# EAGLE design Auxiliary-Payload v3.6 (EAGLE 7.2.0)
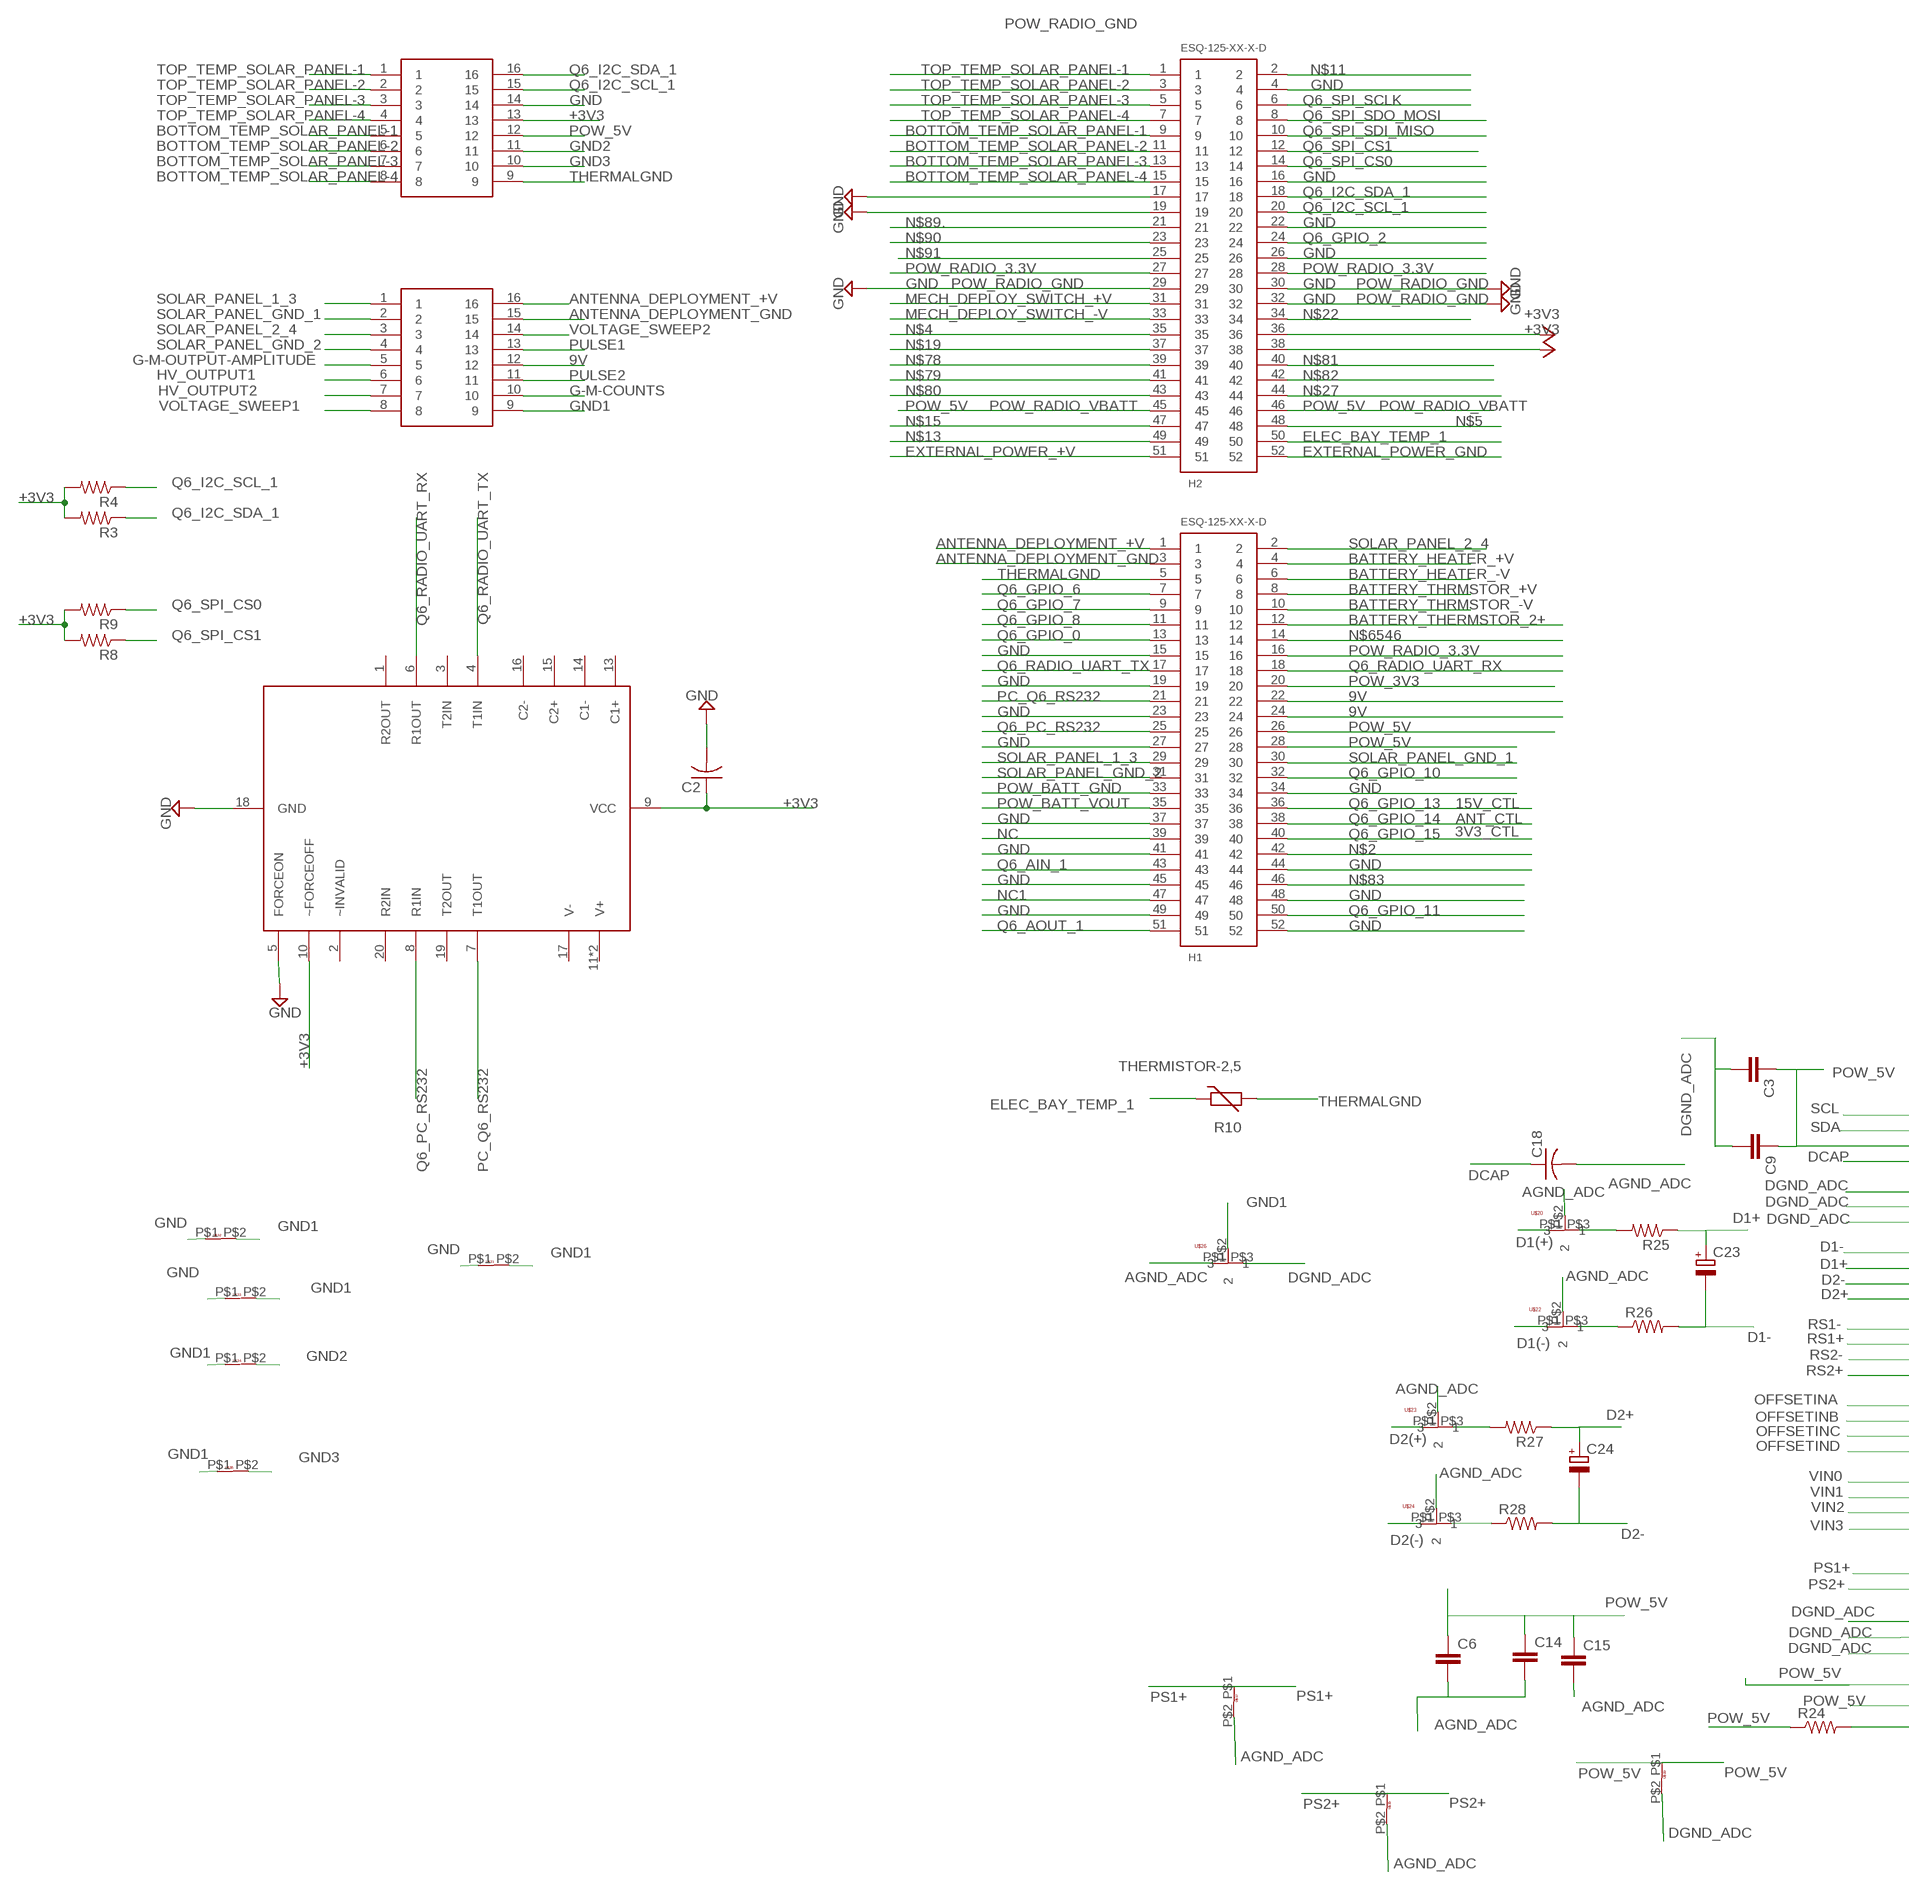
[diagram p0: schematic, sheet 1, part 1 of 2]
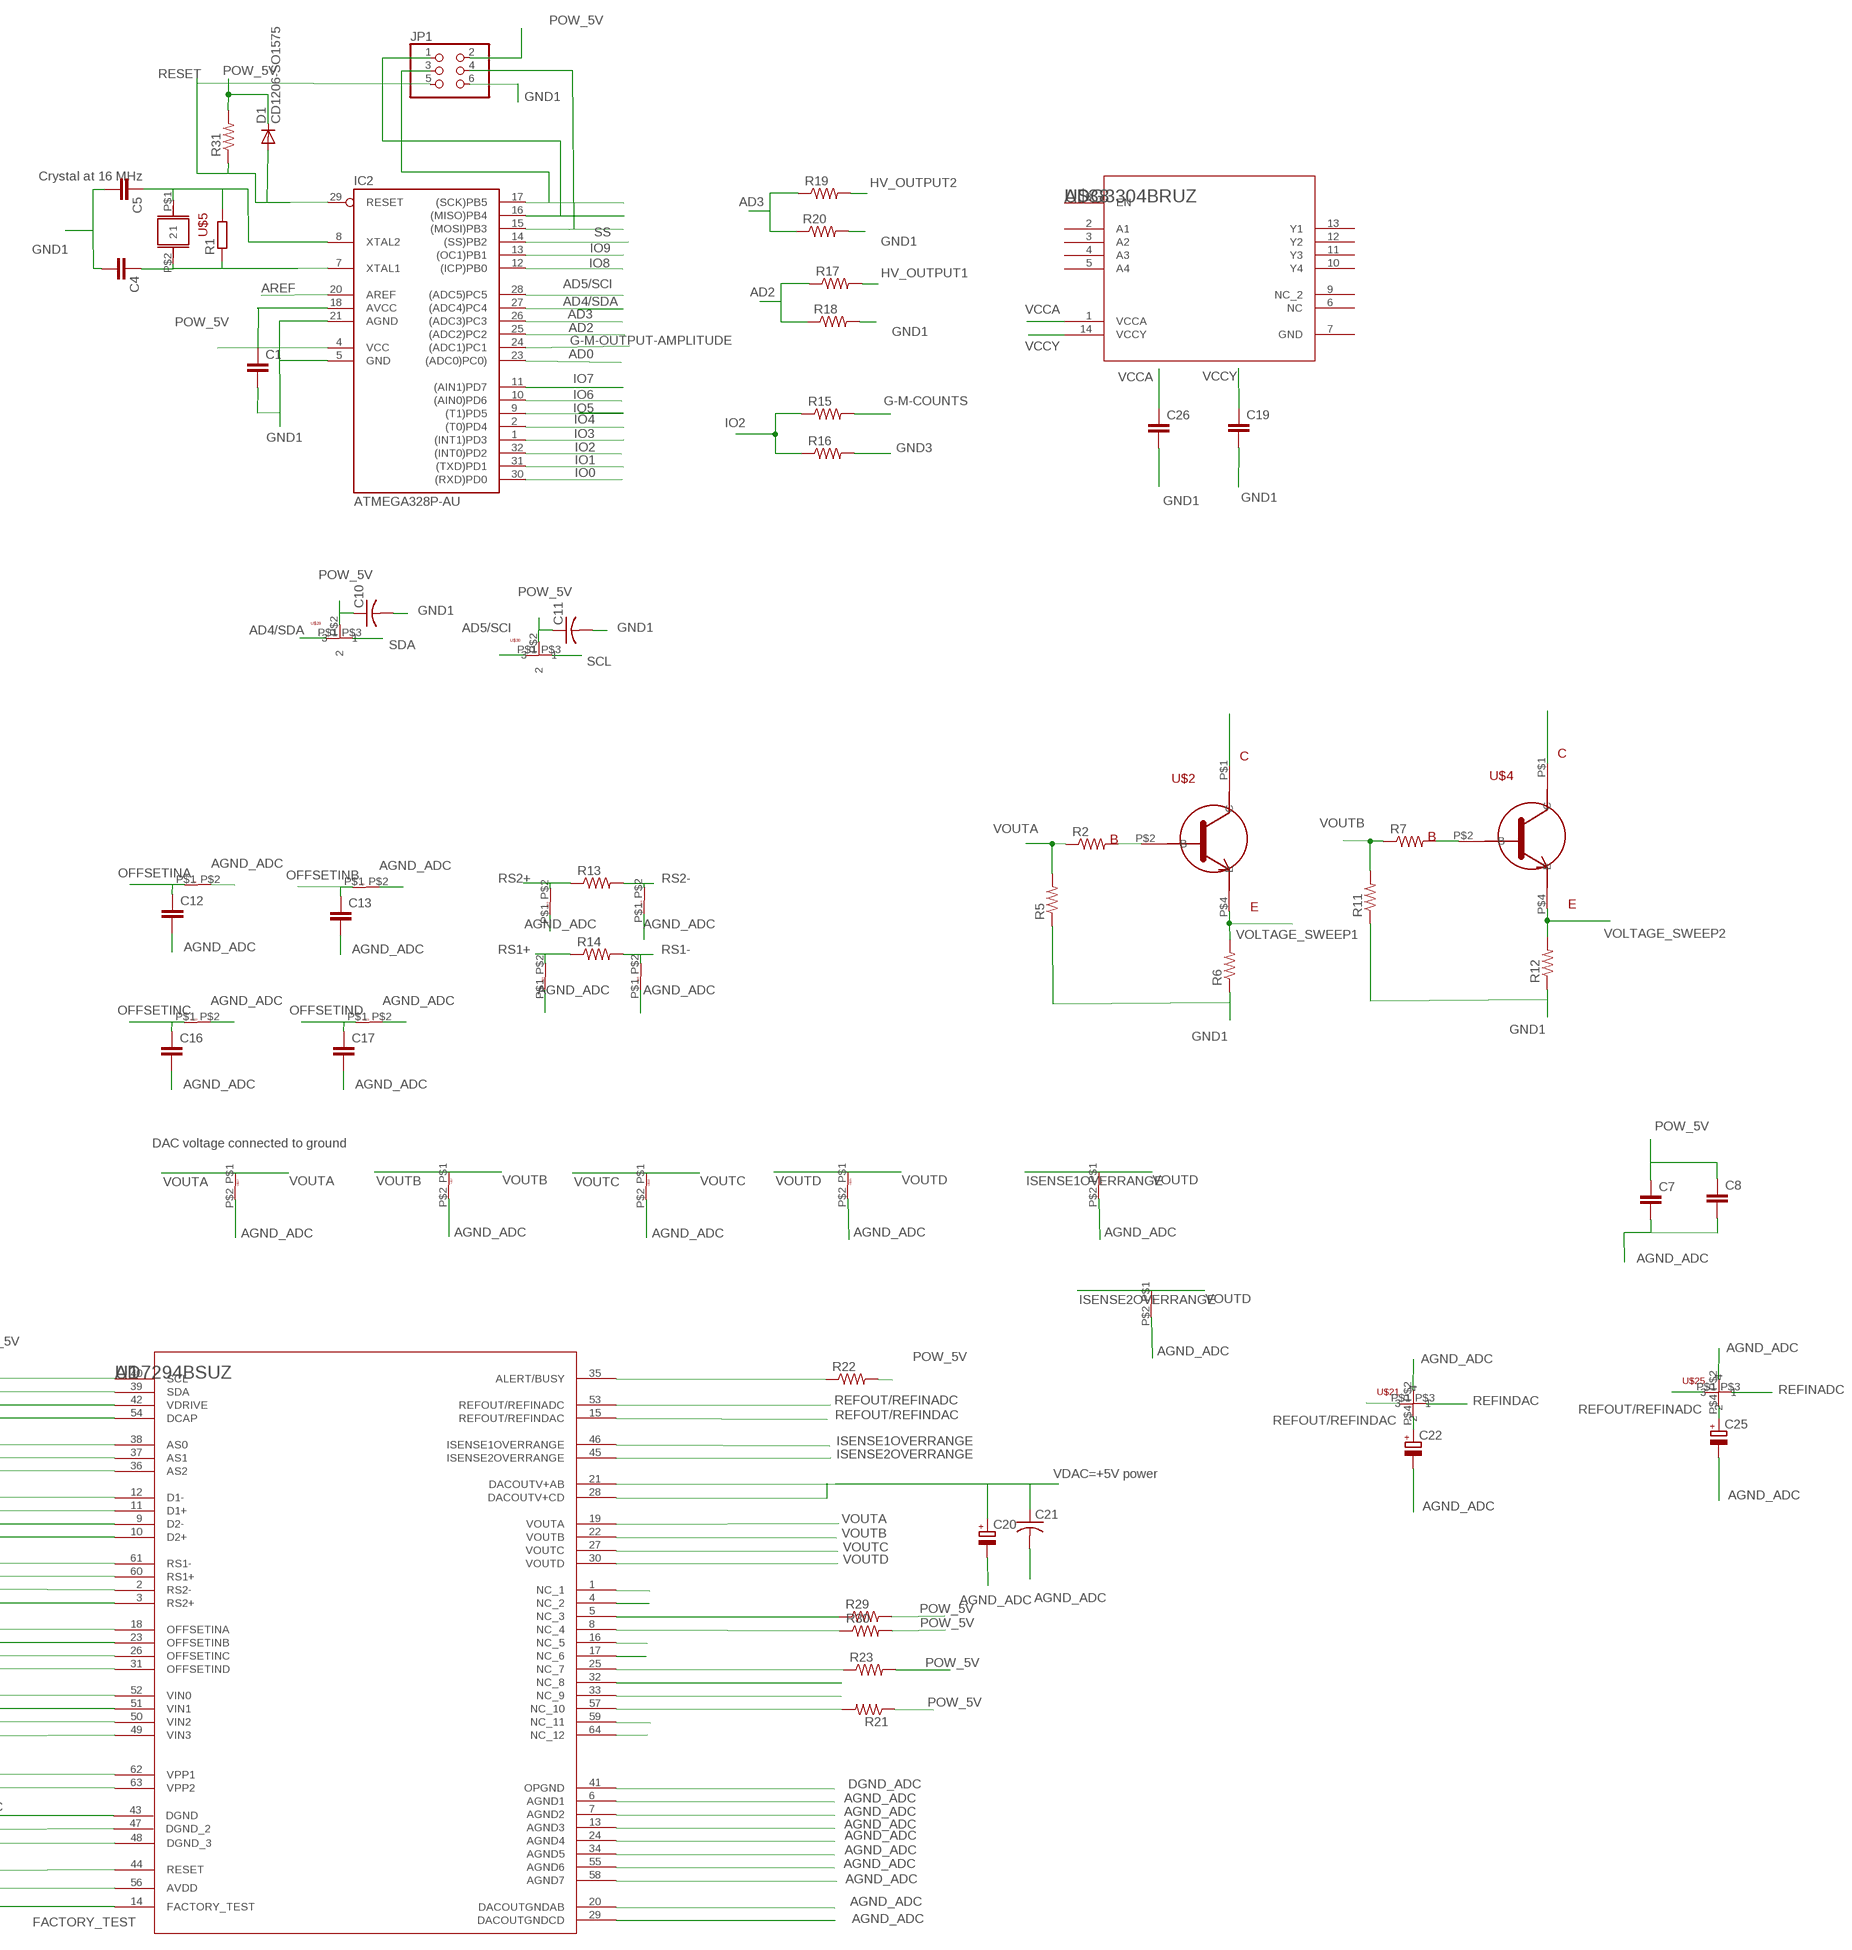
[diagram p1: schematic, sheet 1, part 2 of 2]

## Parts
C1  C-EUC0603  [C0603-ROUND]
C2  C-USC2012  [C2012]
C3  C-EUC1206  [C1206]
C4  C-EUC0603  [C0603-ROUND]
C5  C-EUC0603  [C0603-ROUND]
C6  C-EUC1206  [C1206]
C7  C-EUC1206  [C1206]
C8  C-EUC0603  [C0603]
C9  C-EUC0603  [C0603]
C10  C-USC1210  [C1210]
C11  C-USC1210  [C1210]
C12  C-EUC0603  [C0603]
C13  C-EUC0603  [C0603]
C14  C-EUC0603  [C0603]
C15  C-EUC0603  [C0603]
C16  C-EUC0603  [C0603]
C17  C-EUC0603  [C0603]
C18  C-USC0603  [C0603]
C19  C-EUC0603  [C0603]
C20  CPOL-EUC/6032-28W  [C/6032-28W]
C21  C-USC0603  [C0603]
C22  CPOL-EUC/6032-28W  [C/6032-28W]
C23  CPOL-EUC/6032-28W  [C/6032-28W]
C24  CPOL-EUC/6032-28W  [C/6032-28W]
C25  CPOL-EUC/6032-28W  [C/6032-28W]
C26  C-EUC0603  [C0603]
D1  CD1206-SO1575  DIODE-MINIMELF  [MINIMELF]
H1  ESQ-125-XX-X-D  [ESQ-125-XX-X-D]
H2  ESQ-125-XX-X-D  [ESQ-125-XX-X-D]
IC2  ATMEGA328P-AU  [TQFP32-08]
JP1  PINHD-2X3  [2X03]
R1  R-EU_0603-RND  [R0603-ROUND]
R2  R-US_R1206  [R1206]
R3  R-US_R2012  [R2012]
R4  R-US_R2012  [R2012]
R5  R-US_R2010  [R2010]
R6  R-US_R2010  [R2010]
R7  R-US_R1206  [R1206]
R8  R-US_R2012  [R2012]
R9  R-US_R2012  [R2012]
R10  THERMISTOR-2,5  [RS-2,5]
R11  R-US_R2010  [R2010]
R12  R-US_R2010  [R2010]
R13  R-US_R0805  [R0805]
R14  R-US_R0805  [R0805]
R15  R-US_R1206  [R1206]
R16  R-US_R1206  [R1206]
R17  R-US_R0805  [R0805]
R18  R-US_R0805  [R0805]
R19  R-US_R0805  [R0805]
R20  R-US_R0805  [R0805]
R21  R-US_R0603  [R0603]
R22  R-US_R0805  [R0805]
R23  R-US_R0603  [R0603]
R24  R-US_R0603  [R0603]
R25  R-US_R0603  [R0603]
R26  R-US_R0603  [R0603]
R27  R-US_R0603  [R0603]
R28  R-US_R0603  [R0603]
R29  R-US_R0603  [R0603]
R30  R-US_R0603  [R0603]
R31  R-US_R0603  [R0603]
U1  AD7294BSUZ  [SU_64_1]
U$1  M80-866XXXX  [M80-866XXXX]
U$2  FZT651-NPN-TRANSISTOR  [SOT223-PZT3904]
U$3  M80-866XXXX  [M80-866XXXX]
U$4  FZT651-NPN-TRANSISTOR  [SOT223-PZT3904]
U$5  CSM-7X-DU-CRYSTAL-ARDUINO  [CSM-7X-DU-CRYSTAL]
U$6  CONNECTOR-SHORT  [CONNECTOR-T]
U$7  CONNECTOR-SHORT  [CONNECTOR-T]
U$8  MAX3233  [SO20L]
U$9  CONNECTOR-SHORT  [CONNECTOR-T]
U$10  CONNECTOR-SHORT  [CONNECTOR-T]
U$11  CONNECTOR-SHORT  [CONNECTOR-T]
U$12  CONNECTOR-SHORT  [CONNECTOR-T]
U$13  CONNECTOR-SHORT  [CONNECTOR-T]
U$14  CONNECTOR-SHORT  [CONNECTOR-T]
U$15  CONNECTOR-SHORT  [CONNECTOR-T]
U$16  CONNECTOR-SHORT  [CONNECTOR-T]
U$17  CONNECTOR-SHORT  [CONNECTOR-T]
U$18  CONNECTOR-SHORT  [CONNECTOR-T]
U$19  CONNECTOR-SHORT  [CONNECTOR-T]
U$20  CONNECTOR-3  [CONNECTOR-3T]
U$21  CONNECTOR-4  [CONNECTOR-4T]
U$22  CONNECTOR-3  [CONNECTOR-3T]
U$23  CONNECTOR-3  [CONNECTOR-3T]
U$24  CONNECTOR-3  [CONNECTOR-3T]
U$25  CONNECTOR-4  [CONNECTOR-4T]
U$26  CONNECTOR-3  [CONNECTOR-3T]
U$27  CONNECTOR-SHORT  [CONNECTOR-T]
U$28  CONNECTOR-SHORT  [CONNECTOR-T]
U$29  CONNECTOR-3  [CONNECTOR-3T]
U$30  CONNECTOR-3  [CONNECTOR-3T]
U$31  CONNECTOR-SHORT  [CONNECTOR-T]
U$32  CONNECTOR-SHORT  [CONNECTOR-T]
U$33  CONNECTOR-SHORT  [CONNECTOR-T]
U$34  CONNECTOR-SHORT  [CONNECTOR-T]
U$35  CONNECTOR-SHORT  [CONNECTOR-T]
U$36  CONNECTOR-SHORT  [CONNECTOR-T]
U$37  CONNECTOR-SHORT  [CONNECTOR-T]
U$38  ADG3304BRUZ  [RU_14]

## Nets
9V: H1.22 H1.24 U$1.12
+3V3: C2.1 H2.36 H2.38 R3.2 R4.2 R8.2 R9.2 U$3.13 U$8.9(VCC) U$8.10(~FORCEOFF)
AD0: IC2.23((ADC0)PC0))
AD2: IC2.25((ADC2)PC2) R17.1 R18.1
AD3: IC2.26((ADC3)PC3) R19.1 R20.1
AD4/SDA: IC2.27((ADC4)PC4) U$29.P$1
AD5/SCI: IC2.28((ADC5)PC5) U$30.P$1
AGND_ADC: C3.2 C6.2 C7.2 C8.2 C9.2 C12.2 C13.2 C14.2 C15.2 C16.2 C17.2 C18.2 C20.- C21.2 C22.- C25.- U1.6(AGND1) U1.7(AGND2) U1.13(AGND3) U1.20(DACOUTGNDAB) U1.24(AGND4) U1.29(DACOUTGNDCD) U1.34(AGND5) U1.55(AGND6) U1.58(AGND7) U$6.P$2(OUT) U$7.P$2(OUT) U$9.P$2(OUT) U$10.P$2(OUT) U$11.P$2(OUT) U$12.P$2(OUT) U$13.P$1(IN) U$14.P$1(IN) U$15.P$1(IN) U$16.P$1(IN) U$17.P$2(OUT) U$18.P$2(OUT) U$19.P$2(OUT) U$20.P$2 U$21.P$2 U$22.P$2 U$23.P$2 U$24.P$2 U$25.P$2 U$26.P$1 U$27.P$2(OUT) U$35.P$2(OUT) U$37.P$2(OUT)
ALERT/BUSY: R22.1 U1.35(ALERT/BUSY)
ANTENNA_DEPLOYMENT_+V: H1.1 U$1.16
ANTENNA_DEPLOYMENT_GND: H1.3 U$1.15
AREF: IC2.20(AREF)
BATTERY_HEATER_+V: H1.4
BATTERY_HEATER_-V: H1.6
BATTERY_THERMSTOR_2+: H1.12
BATTERY_THRMSTOR_+V: H1.8
BATTERY_THRMSTOR_-V: H1.10
BOTTOM_TEMP_SOLAR_PANEL-1: H2.9 U$3.5
BOTTOM_TEMP_SOLAR_PANEL-2: H2.11 U$3.6
BOTTOM_TEMP_SOLAR_PANEL-3: H2.13 U$3.7
BOTTOM_TEMP_SOLAR_PANEL-4: H2.15 U$3.8
D1(+): U$20.P$1
D1(-): U$22.P$1
D1+: C23.+ R25.1 U1.11(D1+)
D1-: C23.- R26.2 U1.12(D1-)
D2(+): U$23.P$1
D2(-): U$24.P$1
D2+: C24.+ R27.1 U1.10(D2+)
D2-: C24.- R28.2 U1.9(D2-)
DCAP: C18.1 U1.54(DCAP)
DGND_ADC: U1.36(AS2) U1.37(AS1) U1.38(AS0) U1.41(OPGND) U1.43(DGND) U1.47(DGND_2) U1.48(DGND_3) U$26.P$3 U$28.P$2(OUT)
ELEC_BAY_TEMP_1: H2.50 R10.1
EXTERNAL_POWER_+V: H2.51
EXTERNAL_POWER_GND: H2.52
FACTORY_TEST: R24.2 U1.14(FACTORY_TEST)
G-M-COUNTS: R15.2 U$1.10
G-M-OUTPUT-AMPLITUDE: IC2.24((ADC1)PC1) U$1.5
GND: H1.15 H1.19 H1.23 H1.27 H1.34 H1.37 H1.41 H1.44 H1.45 H1.48 H1.49 H1.52 H2.4 H2.16 H2.17 H2.19 H2.22 H2.26 H2.29 H2.30 H2.32 U$3.14 U$31.P$1(IN) U$32.P$1(IN) U$33.P$1(IN)
GND1: C1.2 C2.2 C4.2 C5.2 C10.2 C11.2 C19.2 C26.2 IC2.5(GND) IC2.21(AGND) JP1.6 R5.1 R6.1 R11.1 R12.1 R18.2 R20.2 U$1.9 U$8.5(FORCEON) U$8.18(GND) U$26.P$2 U$31.P$2(OUT) U$32.P$2(OUT) U$33.P$2(OUT) U$34.P$1(IN) U$36.P$1(IN) ; supply symbol labelled GND
GND2: U$3.11 U$34.P$2(OUT)
GND3: R16.2 U$3.10 U$36.P$2(OUT)
HV_OUTPUT1: R17.2 U$1.6
HV_OUTPUT2: R19.2 U$1.7
IO0: IC2.30((RXD)PD0)
IO1: IC2.31((TXD)PD1)
IO2: IC2.32((INT0)PD2) R15.1 R16.1
IO3: IC2.1((INT1)PD3)
IO4: IC2.2((T0)PD4)
IO5: IC2.9((T1)PD5)
IO6: IC2.10((AIN0)PD6)
IO7: IC2.11((AIN1)PD7)
IO8: IC2.12((ICP)PB0)
IO9: IC2.13((OC1)PB1)
ISENSE1OVERRANGE: U1.46(ISENSE1OVERRANGE) U$12.P$1(IN)
ISENSE2OVERRANGE: U1.45(ISENSE2OVERRANGE) U$27.P$1(IN)
MECH_DEPLOY_SWITCH_+V: H2.31
MECH_DEPLOY_SWITCH_-V: H2.33
N$2: H1.42
N$3: IC2.16((MISO)PB4) JP1.1
N$4: H2.35
N$5: H2.48
N$11: H2.2
N$12: R28.1 U$24.P$3
N$13: H2.49
N$14: C22.+ U$21.P$4
N$15: H2.47
N$16: R27.2 U$23.P$3
N$17: C25.+ U$25.P$4
N$19: H2.37
N$21: R7.2 U$4.P$2(B)
N$22: H2.34
N$24: R26.1 U$22.P$3
N$25: R25.2 U$20.P$3
N$27: H2.44
N$47: C4.1 IC2.7(XTAL1) R1.1 U$5.P$2
N$48: C5.1 IC2.8(XTAL2) R1.2 U$5.P$1
N$51: IC2.15((MOSI)PB3) JP1.4
N$58: R2.2 U$2.P$2(B)
N$78: H2.39
N$79: H2.41
N$80: H2.43
N$81: H2.40
N$82: H2.42
N$83: H1.46
N$89.: H2.21
N$90: H2.23
N$91: H2.25
N$6546: H1.14
NC: H1.39
NC1: H1.47
NC_1: U1.1(NC_1)
NC_2: U1.4(NC_2)
NC_3: R29.1 U1.5(NC_3)
NC_4: R30.1 U1.8(NC_4)
NC_5: U1.16(NC_5)
NC_6: U1.17(NC_6)
NC_7: R23.1 U1.25(NC_7)
NC_8: U1.32(NC_8)
NC_9: U1.33(NC_9)
NC_10: R21.2 U1.57(NC_10)
NC_11: U1.59(NC_11)
NC_12: U1.64(NC_12)
OFFSETINA: C12.1 U1.18(OFFSETINA) U$6.P$1(IN)
OFFSETINB: C13.1 U1.23(OFFSETINB) U$9.P$1(IN)
OFFSETINC: C16.1 U1.26(OFFSETINC) U$10.P$1(IN)
OFFSETIND: C17.1 U1.31(OFFSETIND) U$11.P$1(IN)
PC_Q6_RS232: H1.21 U$8.7(T1OUT)
POW_3V3: H1.20
POW_5V: C1.1 C3.1 C6.1 C7.1 C8.1 C9.1 C10.1 C11.1 C14.1 C15.1 C20.+ C21.1 D1.C H1.26 H1.28 H2.45 H2.46 IC2.4(VCC) IC2.18(AVCC) JP1.2 R21.1 R22.2 R23.2 R24.1 R29.2 R30.2 R31.2 U1.21(DACOUTV+AB) U1.28(DACOUTV+CD) U1.42(VDRIVE) U1.44(RESET) U1.56(AVDD) U$2.P$1(C) U$3.12 U$4.P$1(C) U$28.P$1(IN) U$29.P$2 U$30.P$2
POW_BATT_GND: H1.33
POW_BATT_VOUT: H1.35
POW_RADIO_3.3V: H1.16 H2.27 H2.28
PS1+: U1.62(VPP1) U$37.P$1(IN)
PS2+: U1.63(VPP2) U$35.P$1(IN)
PULSE1: U$1.13
PULSE2: U$1.11
Q6_AIN_1: H1.43
Q6_AOUT_1: H1.51
Q6_GPIO_0: H1.13
Q6_GPIO_2: H2.24
Q6_GPIO_6: H1.7
Q6_GPIO_7: H1.9
Q6_GPIO_8: H1.11
Q6_GPIO_10: H1.32
Q6_GPIO_11: H1.50
Q6_GPIO_13: H1.36
Q6_GPIO_14: H1.38
Q6_GPIO_15: H1.40
Q6_I2C_SCL_1: H2.20 R4.1 U$3.15
Q6_I2C_SDA_1: H2.18 R3.1 U$3.16
Q6_PC_RS232: H1.25 U$8.8(R1IN)
Q6_RADIO_UART_RX: H1.18 U$8.6(R1OUT)
Q6_RADIO_UART_TX: H1.17 U$8.4(T1IN)
Q6_SPI_CS0: H2.14 R9.1
Q6_SPI_CS1: H2.12 R8.1
Q6_SPI_SCLK: H2.6
Q6_SPI_SDI_MISO: H2.10
Q6_SPI_SDO_MOSI: H2.8
REFINADC: U$25.P$3
REFINDAC: U$21.P$3
REFOUT/REFINADC: U1.53(REFOUT/REFINADC) U$25.P$1
REFOUT/REFINDAC: U1.15(REFOUT/REFINDAC) U$21.P$1
RESET: D1.A IC2.29(RESET) JP1.5 R31.1
RS1+: R14.1 U1.60(RS1+) U$15.P$2(OUT)
RS1-: R14.2 U1.61(RS1-) U$16.P$2(OUT)
RS2+: R13.1 U1.3(RS2+) U$13.P$2(OUT)
RS2-: R13.2 U1.2(RS2-) U$14.P$2(OUT)
SCK: IC2.17((SCK)PB5) JP1.3
SCL: U1.40(SCL) U$30.P$3
SDA: U1.39(SDA) U$29.P$3
SOLAR_PANEL_1_3: H1.29 U$1.1
SOLAR_PANEL_2_4: H1.2 U$1.3
SOLAR_PANEL_GND_1: H1.30 U$1.2
SOLAR_PANEL_GND_2: H1.31 U$1.4
SS: IC2.14((SS)PB2)
THERMALGND: H1.5 R10.2 U$3.9
TOP_TEMP_SOLAR_PANEL-1: H2.1 U$3.1
TOP_TEMP_SOLAR_PANEL-2: H2.3 U$3.2
TOP_TEMP_SOLAR_PANEL-3: H2.5 U$3.3
TOP_TEMP_SOLAR_PANEL-4: H2.7 U$3.4
VCCA: C26.1 U$38.1(VCCA)
VCCY: C19.1 U$38.14(VCCY)
VIN0: U1.52(VIN0)
VIN1: U1.51(VIN1)
VIN2: U1.50(VIN2)
VIN3: U1.49(VIN3)
VOLTAGE_SWEEP1: R6.2 U$1.8 U$2.P$4(E)
VOLTAGE_SWEEP2: R12.2 U$1.14 U$4.P$4(E)
VOUTA: R2.1 R5.2 U1.19(VOUTA) U$17.P$1(IN)
VOUTB: R7.1 R11.2 U1.22(VOUTB) U$7.P$1(IN)
VOUTC: U1.27(VOUTC) U$18.P$1(IN)
VOUTD: U1.30(VOUTD) U$19.P$1(IN)
Unconnected: U$8.1(R2OUT) U$8.2(~INVALID) U$8.3(T2IN) U$8.11(V+) U$8.12(V+) U$8.13(C1+) U$8.14(C1-) U$8.15(C2+) U$8.16(C2-) U$8.17(V-) U$8.19(T2OUT) U$8.20(R2IN) U$38.2(A1) U$38.3(A2) U$38.4(A3) U$38.5(A4) U$38.6(NC) U$38.7(GND) U$38.8(EN) U$38.9(NC_2) U$38.10(Y4) U$38.11(Y3) U$38.12(Y2) U$38.13(Y1)

## Notes on the sheet
- Crystal at 16 MHz
- POW_RADIO_GND
- POW_RADIO_GND | POW_RADIO_GND
- POW_RADIO_GND
- POW_RADIO_VBATT | POW_RADIO_VBATT
- SOLAR_PANEL_2_4
- 15V_CTL
- ANT_CTL
- 3V3_CTL
- DAC voltage connected to ground
- VDAC=+5V power

## Library data of the parts
C1 C4 C5 = SmartPrj:C-EU: CAPACITOR, European symbol
C2 C10 C11 C18 C21 = rcl:C-US: CAPACITOR, American symbol
C3 C6-C9 C12-C17 C19 C26 = rcl:C-EU: CAPACITOR, European symbol
C20 C22-C25 = rcl:CPOL-EU: POLARIZED CAPACITOR, European symbol
D1 = diode:DIODE-: DIODE
H1 H2 = ESQ-126-XX-X-D:ESQ-125-XX-X-D: ELEVATED SOCKET, .100 inch(2.54mm) PITCH
IC2 = SmartPrj:ATMEGA328P-: MICROCONTROLLER 4 Kbytes FLASH 128 bytes SRAM 256 bytes EEPROM UART 6-channel 10 bit ADC
JP1 = SmartPrj:PINHD-2X3: PIN HEADER
R1 = SmartPrj:R-EU_: RESISTOR, European symbol
R2 R5-R7 R11-R31 = rcl:R-US_: RESISTOR, American symbol
R3 R4 R8 R9 = resistor:R-US_: RESISTOR, American symbol
R10 = varistor:THERMISTOR: THERMISTOR
U1 = AD-library:AD7294BSUZ: AD7294-2BSUZ
U$1 U$3 = harwin:M80-866XXXX
U$2 U$4 = Payload-board:FZT651-NPN-TRANSISTOR
U$5 = Payload-board:CSM-7X-DU-CRYSTAL-ARDUINO
U$6 U$7 U$9-U$19 U$27 U$28 U$31-U$37 = Payload-board:CONNECTOR-SHORT
U$8 = max3233:MAX3233
U$20 U$22-U$24 U$26 U$29 U$30 = Payload-board:CONNECTOR-3
U$21 U$25 = Payload-board:CONNECTOR-4
U$38 = ADG3304:ADG3304BRUZ

## Net classes
0 default: width 0.406 mm

## Board
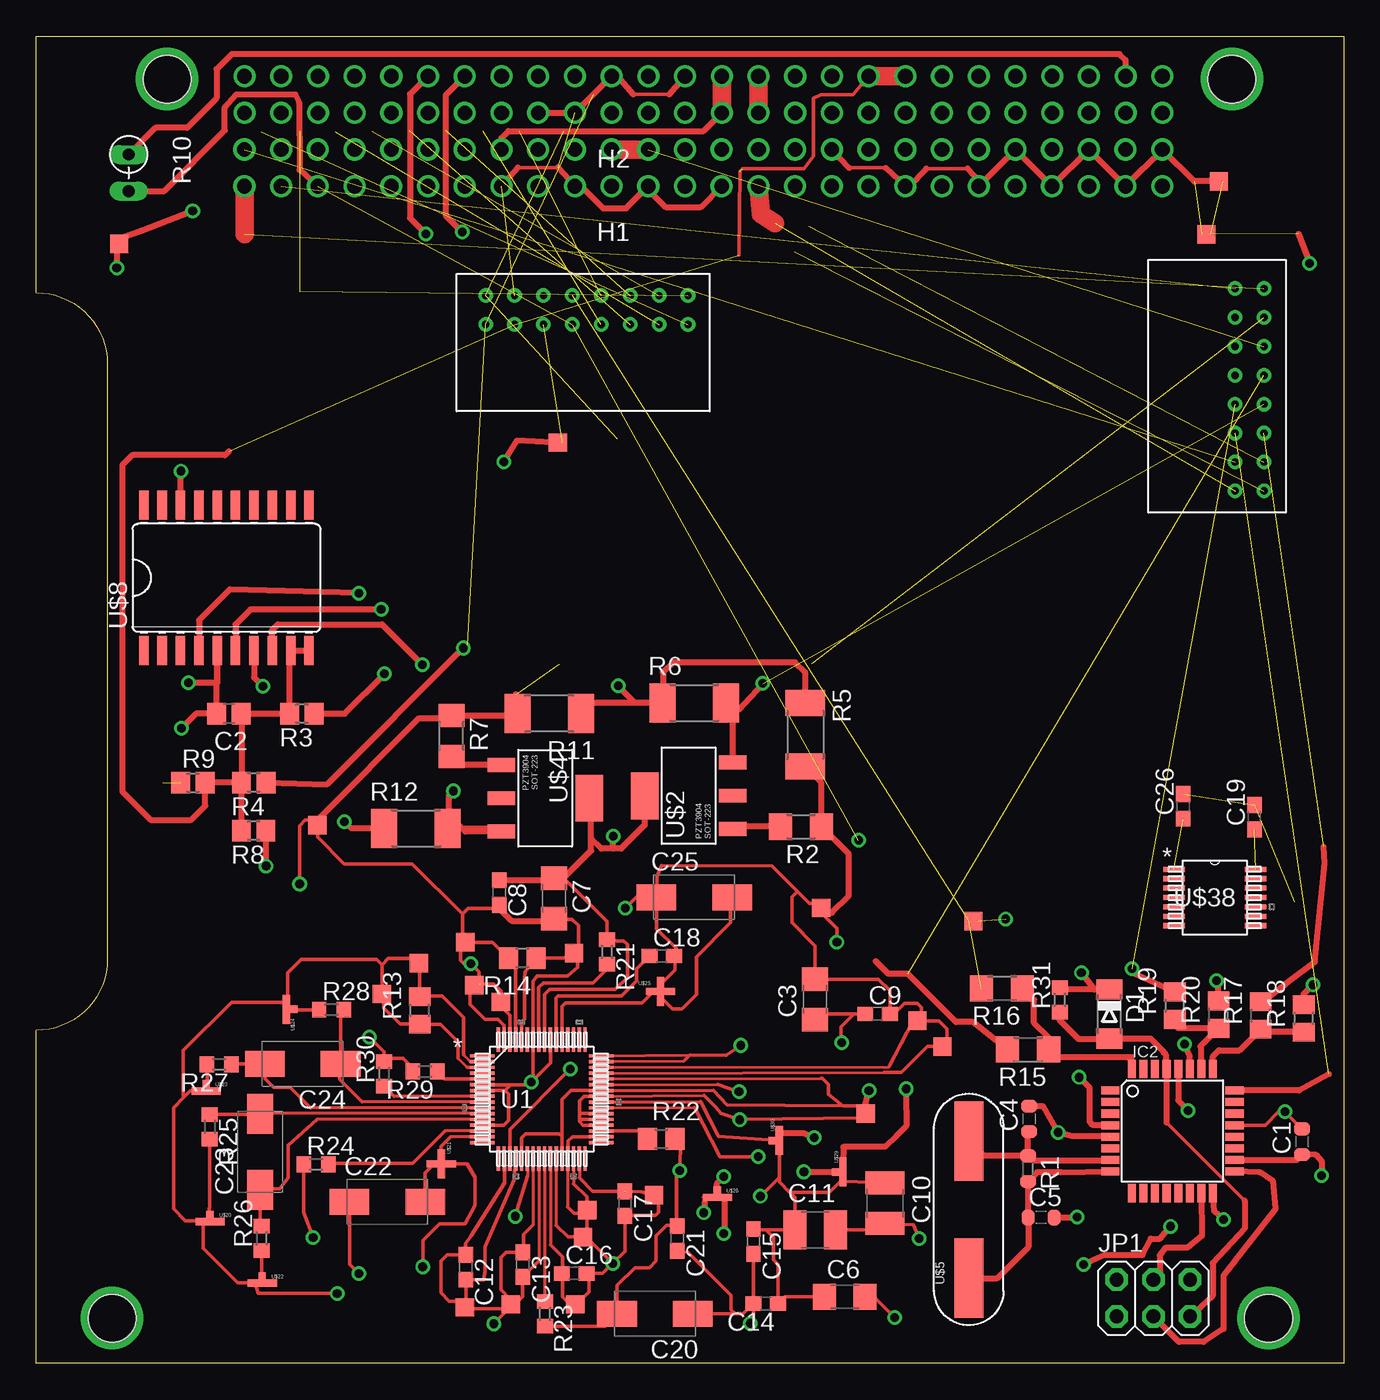
[diagram p2: board, top side]
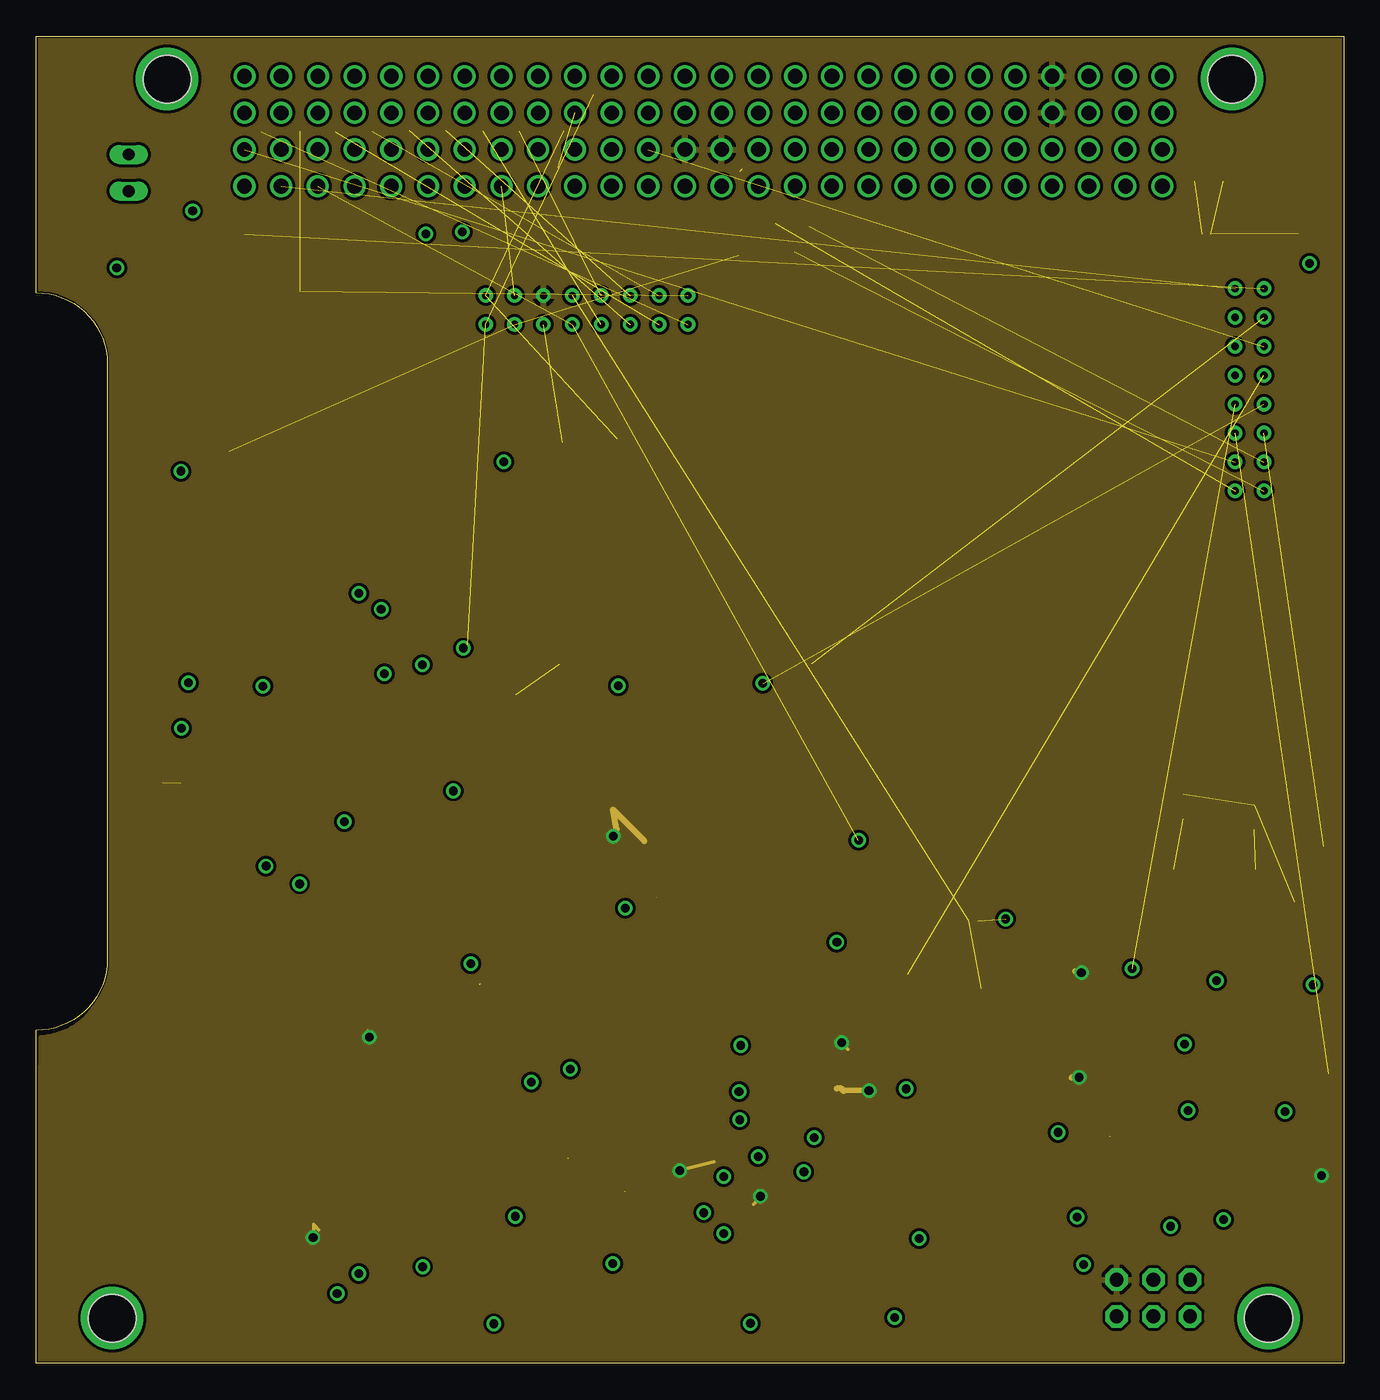
[diagram p3: board, inner layer POW_5V]
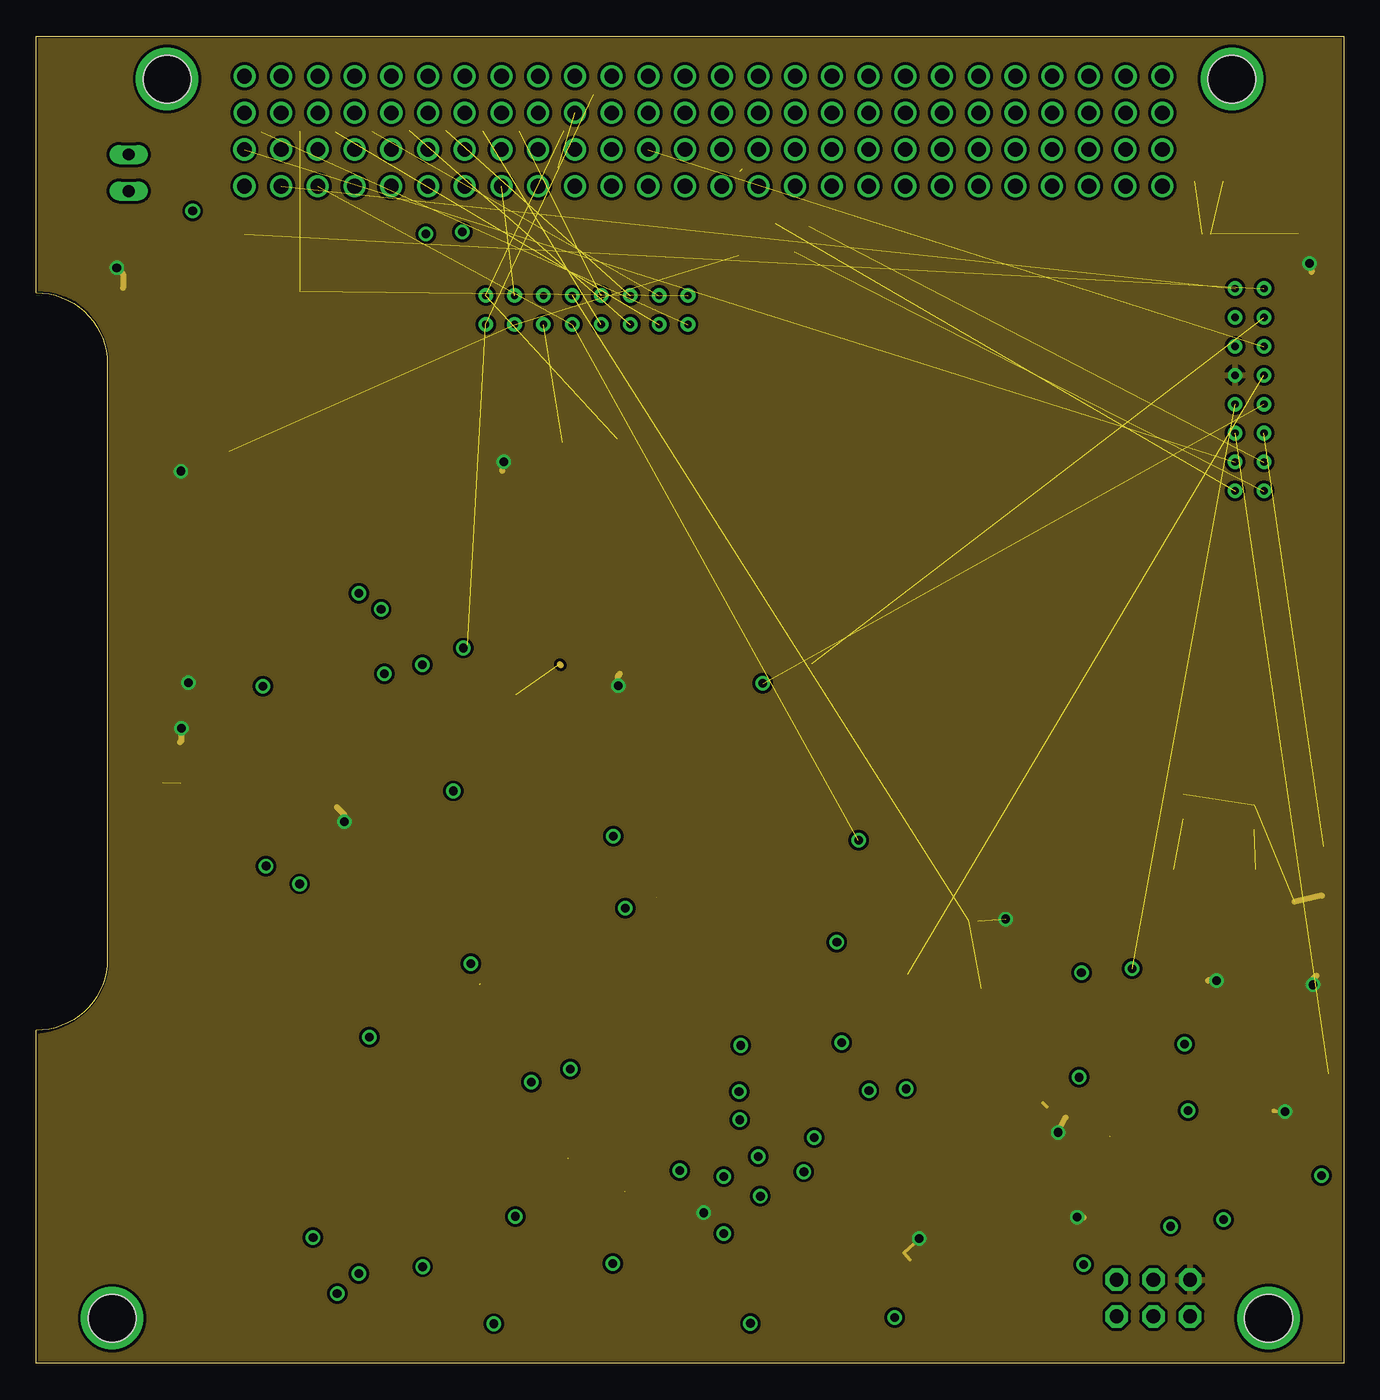
[diagram p4: board, inner layer GND1]
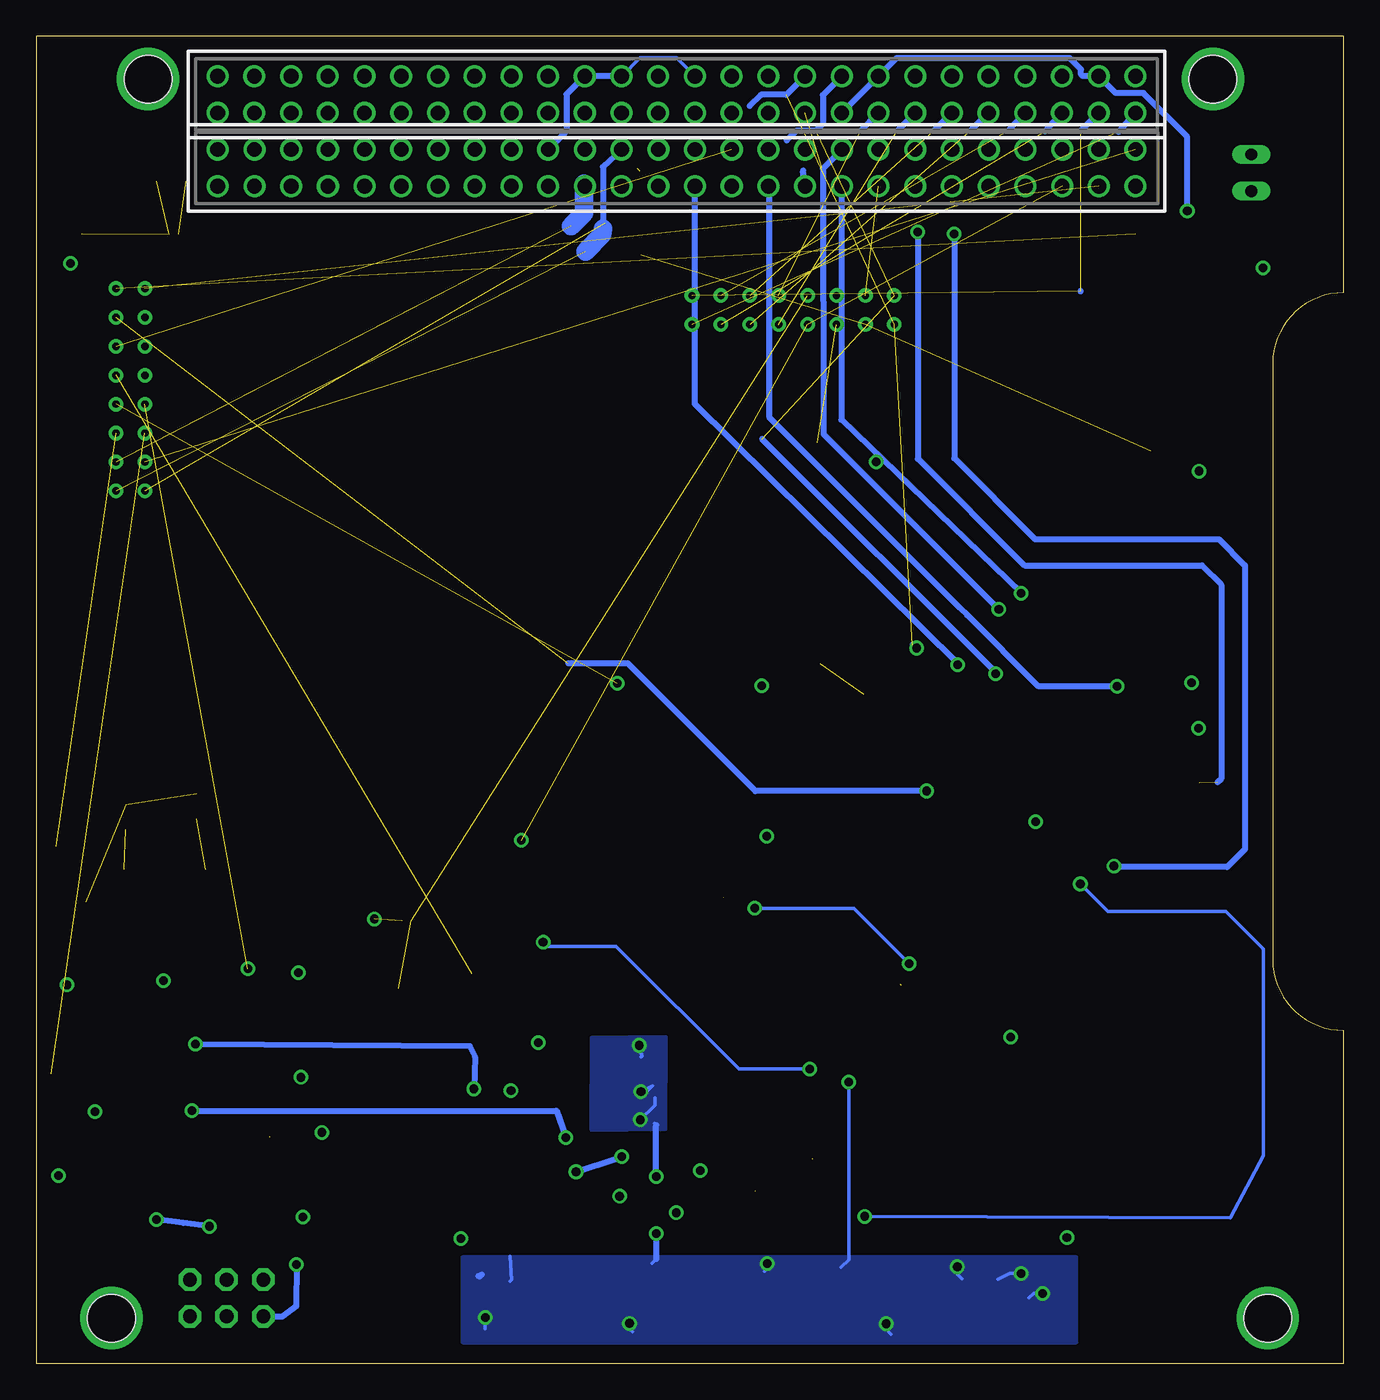
[diagram p5: board, bottom side, seen from below]

Size 90.47 x 91.83 mm. Coordinates in mm from the lower left corner, seen from the top.
Outline: 0,0 0,23.04 arc90 4.93,27.96 4.93,69.15 arc90 0,74.08 0,91.83 90.47,91.83 90.47,0 0,0
Copper layers (1*2+15*16): Top 0.035mm / dielectric 0.5mm / POW_5V 0.035mm / dielectric 0.5mm / GND1 0.035mm / dielectric 0.5mm / Bottom 0.035mm
Design rules "default *": minimum track width 8mil, minimum drill 4mil, track to track 8mil, track to pad 8mil, pad to pad 8mil, via to via 8mil, smd to smd 8mil, copper to edge 5mil, drill to drill 5mil, minimum pad ring 10mil, minimum via ring 8mil, stop-mask expansion 1mil, vias tented up to drill 0mil, thermal gap 10mil
Holes 3.3 mm at 9.07,88.85 82.73,88.85 5.26,3.13 85.27,3.13

### Footprints (pad centres in the part's own frame; a part is rotated, then mirrored left to right if it is on the bottom)
C0603-ROUND = smd 0.898 x 1.1: 1 -0.889,0; 2 0.889,0
C2012 = smd 1.3 x 1.5: 1 -0.85,0; 2 0.85,0
C1206 = smd 1.6 x 1.8: 1 -1.4,0; 2 1.4,0
C0603 = smd 1.1 x 1: 1 -0.85,0; 2 0.85,0
C1210 = smd 1.6 x 2.7: 1 -1.4,0; 2 1.4,0
C/6032-28W = smd 2.75 x 1.8: + 2.625,0; - -2.625,0
MINIMELF = smd 1.4 x 1.8: A 1.7,0; C -1.7,0
ESQ-125-XX-X-D = drill 1.016 pad 1.524: 1 -27.94,-1.27; 2 -27.94,1.27; 3 -25.4,-1.27; 4 -25.4,1.27; 5 -22.86,-1.27; 6 -22.86,1.27; 7 -20.32,-1.27; 8 -20.32,1.27; 9 -17.78,-1.27; 10 -17.78,1.27; 11 -15.24,-1.27; 12 -15.24,1.27; 13 -12.7,-1.27; 14 -12.7,1.27; 15 -10.16,-1.27; 16 -10.16,1.27; 17 -7.62,-1.27; 18 -7.62,1.27; 19 -5.08,-1.27; 20 -5.08,1.27; 21 -2.54,-1.27; 22 -2.54,1.27; 23 0,-1.27; 24 0,1.27; 25 2.54,-1.27; 26 2.54,1.27; 27 5.08,-1.27; 28 5.08,1.27; 29 7.62,-1.27; 30 7.62,1.27; 31 10.16,-1.27; 32 10.16,1.27; 33 12.7,-1.27; 34 12.7,1.27; 35 15.24,-1.27; 36 15.24,1.27; 37 17.78,-1.27; 38 17.78,1.27; 39 20.32,-1.27; 40 20.32,1.27; 41 22.86,-1.27; 42 22.86,1.27; 43 25.4,-1.27; 44 25.4,1.27; 45 27.94,-1.27; 46 27.94,1.27; 47 30.48,-1.27; 48 30.48,1.27; 49 33.02,-1.27; 50 33.02,1.27; 51 35.56,-1.27; 52 35.56,1.27
TQFP32-08 = smd 1.27 x 0.559: 1 -4.293,2.8; 2 -4.293,2; 3 -4.293,1.2; 4 -4.293,0.4; 5 -4.293,-0.4; 6 -4.293,-1.2; 7 -4.293,-2; 8 -4.293,-2.8; 17 4.293,-2.8; 18 4.293,-2; 19 4.293,-1.2; 20 4.293,-0.4; 21 4.293,0.4; 22 4.293,1.2; 23 4.293,2; 24 4.293,2.8 | smd 0.559 x 1.27: 9 -2.8,-4.293; 10 -2,-4.293; 11 -1.2,-4.293; 12 -0.4,-4.293; 13 0.4,-4.293; 14 1.2,-4.293; 15 2,-4.293; 16 2.8,-4.293; 25 2.8,4.293; 26 2,4.293; 27 1.2,4.293; 28 0.4,4.293; 29 -0.4,4.293; 30 -1.2,4.293; 31 -2,4.293; 32 -2.8,4.293
2X03 = drill 0.95 pad 1.55 octagon: 1 -2.54,-1.27; 2 -2.54,1.27; 3 0,-1.27; 4 0,1.27; 5 2.54,-1.27; 6 2.54,1.27
R0603-ROUND = smd 0.898 x 1.1: 1 -0.889,0; 2 0.889,0
R1206 = smd 1.6 x 1.803: 1 -1.422,0; 2 1.422,0
R2012 = smd 1.3 x 1.5: 1 -0.85,0; 2 0.85,0
R2010 = smd 1.8 x 2.7: 1 -2.2,0; 2 2.2,0
RS-2,5 = drill 0.813 long: 1 -1.27,0; 2 1.27,0
R0805 = smd 1.3 x 1.5: 1 -0.95,0; 2 0.95,0
R0603 = smd 1 x 1.1: 1 -0.85,0; 2 0.85,0
SU_64_1 = smd 1.676 x 0.229: 1 -4.115,3; 2 -4.115,2.6; 3 -4.115,2.2; 4 -4.115,1.8; 5 -4.115,1.4; 6 -4.115,1; 7 -4.115,0.6; 8 -4.115,0.2; 9 -4.115,-0.2; 10 -4.115,-0.6; 11 -4.115,-1; 12 -4.115,-1.4; 13 -4.115,-1.8; 14 -4.115,-2.2; 15 -4.115,-2.6; 16 -4.115,-3; 33 4.115,-3; 34 4.115,-2.6; 35 4.115,-2.2; 36 4.115,-1.8; 37 4.115,-1.4; 38 4.115,-1; 39 4.115,-0.6; 40 4.115,-0.2; 41 4.115,0.2; 42 4.115,0.6; 43 4.115,1; 44 4.115,1.4; 45 4.115,1.8; 46 4.115,2.2; 47 4.115,2.6; 48 4.115,3 | smd 0.229 x 1.676: 17 -3,-4.115; 18 -2.6,-4.115; 19 -2.2,-4.115; 20 -1.8,-4.115; 21 -1.4,-4.115; 22 -1,-4.115; 23 -0.6,-4.115; 24 -0.2,-4.115; 25 0.2,-4.115; 26 0.6,-4.115; 27 1,-4.115; 28 1.4,-4.115; 29 1.8,-4.115; 30 2.2,-4.115; 31 2.6,-4.115; 32 3,-4.115; 49 3,4.115; 50 2.6,4.115; 51 2.2,4.115; 52 1.8,4.115; 53 1.4,4.115; 54 1,4.115; 55 0.6,4.115; 56 0.2,4.115; 57 -0.2,4.115; 58 -0.6,4.115; 59 -1,4.115; 60 -1.4,4.115; 61 -1.8,4.115; 62 -2.2,4.115; 63 -2.6,4.115; 64 -3,4.115
M80-866XXXX = drill 0.5: 1 -7,1; 2 -7,-1; 3 -5,1; 4 -5,-1; 5 -3,1; 6 -3,-1; 7 -1,1; 8 -1,-1; 9 1,1; 10 1,-1; 11 3,1; 12 3,-1; 13 5,1; 14 5,-1; 15 7,1; 16 7,-1
SOT223-PZT3904 = smd 3.25 x 1.9: P$1 0,3.05 | smd 0.95 x 1.9: P$2 -2.3,-3.05; P$3 0,-3.05; P$4 2.3,-3.05
CSM-7X-DU-CRYSTAL = smd 5.5 x 2: P$1 -4.75,0; P$2 4.75,0
CONNECTOR-T = smd 0.635 x 1.27: P$1 -0.31,-0.03; P$2 0.31,-0.03
SO20L = smd 0.66 x 2.032: 1 -5.715,-5.029; 2 -4.445,-5.029; 3 -3.175,-5.029; 4 -1.905,-5.029; 5 -0.635,-5.029; 6 0.635,-5.029; 7 1.905,-5.029; 8 3.175,-5.029; 9 4.445,-5.029; 10 5.715,-5.029; 11 5.715,5.029; 12 4.445,5.029; 13 3.175,5.029; 14 1.905,5.029; 15 0.635,5.029; 16 -0.635,5.029; 17 -1.905,5.029; 18 -3.175,5.029; 19 -4.445,5.029; 20 -5.715,5.029
CONNECTOR-3T = smd 1.016 x 0.508: P$1 -0.5,0; P$2 0.5,0 | smd 0.508 x 1.016: P$3 0.01,-0.25
CONNECTOR-4T = smd 1.016 x 0.508: P$1 -0.5,0; P$3 0.5,0 | smd 0.508 x 1.016: P$2 0,0.5; P$4 0,-0.5
RU_14 = smd 1.473 x 0.356: 1 -2.819,1.95; 2 -2.819,1.3; 3 -2.819,0.65; 4 -2.819,0; 5 -2.819,-0.65; 6 -2.819,-1.3; 7 -2.819,-1.95; 8 2.819,-1.95; 9 2.819,-1.3; 10 2.819,-0.65; 11 2.819,0; 12 2.819,0.65; 13 2.819,1.3; 14 2.819,1.95

### Placement (x,y rotation side)
C1  87.58,15.34 90 top
C2  13.34,44.95 180 top
C3  53.89,25.18 90 top
C4  68.7,16.92 90 top
C5  69.53,10.1 0 top
C6  55.95,4.6 0 top
C7  35.84,32.17 270 top
C8  32.03,32.58 270 top
C9  58.21,24.18 0 top
C10  58.71,11.08 270 top
C11  53.9,9.23 0 top
C12  29.73,6.65 270 top
C13  33.67,6.84 270 top
C14  50.48,4.14 180 top
C15  49.63,8.44 270 top
C16  37.22,6.22 0 top
C17  40.74,11.05 270 top
C18  43.29,28.19 0 top
C19  84.28,37.8 90 top
C20  42.81,3.42 180 top
C21  44.36,8.65 270 top
C22  24.3,11.17 0 top
C23  15.49,14.63 90 top
C24  18.45,20.71 180 top
C25  45.53,32.25 0 top
C26  79.36,38.53 90 top
D1  74.25,24.17 270 top
H1  42.35,82.71 0 top
H2  42.36,87.79 0 top
IC2  78.61,16.08 0 top
JP1  77.3,4.52 0 top
R1  68.62,13.47 270 top
R2  52.91,37.13 180 top
R3  18.39,44.95 180 top
R4  15.06,40.18 180 top
R5  53.21,43.5 270 top
R6  45.52,45.7 0 top
R7  28.74,43.41 270 top
R8  15.05,36.84 180 top
R9  10.85,40.17 0 top
R10  6.4,82.37 270 top
R11  35.51,44.95 180 top
R12  26.28,37.01 0 top
R13  26.54,24.42 90 top
R14  33.63,28.04 180 top
R15  68.63,21.72 180 top
R16  66.82,25.95 180 top
R17  84.72,24.07 90 top
R18  87.7,23.87 90 top
R19  78.78,24.75 90 top
R20  81.8,24.13 90 top
R21  39.5,28.47 270 top
R22  43.25,15.53 0 top
R23  35.2,3.43 270 top
R24  19.36,13.77 0 top
R25  12.02,16.37 270 top
R26  15.6,8.66 90 top
R27  12.67,20.69 180 top
R28  20.43,24.47 0 top
R29  26.9,20.19 180 top
R30  24.07,20.02 90 top
R31  70.82,25.15 90 top
U1  34.98,18.28 0 top
U$1  83.95,67.36 90 top
U$2  45.15,39.27 90 top
U$3  38.1,72.88 180 top
U$4  35.22,39.1 270 top
U$5  64.53,10.64 90 top
U$6  29.7,3.87 270 top
U$7  19.49,37.23 270 top
U$8  13.17,54.35 0 top
U$9  32.87,4.09 270 top
U$10  37.3,4.12 0 top
U$11  42.74,11.68 0 top
U$12  60.97,23.74 0 top
U$13  23.96,25.56 270 top
U$14  26.5,27.69 270 top
U$15  37.21,28.35 180 top
U$16  29.69,29.17 0 top
U$17  54.28,31.5 90 top
U$18  37.83,8.77 0 top
U$19  38.16,10.61 270 top
U$20  12.04,9.8 180 top
U$21  28.03,13.8 270 top
U$22  15.65,5.55 180 top
U$23  11.77,18.84 180 top
U$24  17.32,24.49 90 top
U$25  43.2,25.74 0 top
U$26  47.13,11.49 180 top
U$27  62.71,21.94 0 top
U$28  57.42,17.28 270 top
U$29  55.82,13.24 270 top
U$30  51.42,15.43 270 top
U$31  5.74,77.43 180 top
U$32  80.96,78.14 0 top
U$33  81.83,81.81 0 top
U$34  36.09,63.73 0 top
U$35  30.32,26.2 0 top
U$36  64.85,30.57 180 top
U$37  32.12,25 90 top
U$38  81.55,32.23 0 top

### Tracks (layer width: path | path; a pad name or v marks a point on that pad's centre or on a via)
9V  (1 unrouted)
  Top 1.27: H1.22 H1.24
+3V3  (3 unrouted)
  Top 0.254: 57.59,89.06 56.5,87.77 54.29,87.77 53.78,87.53 53.78,83.53 53.12,82.66 48.87,82.66 | 48.69,82.49 48.64,76.66
  Top 0.406: R3.2 C2.1 14.21,44.95 R4.2 | R3.2 | R4.2 R9.2 11.7,38.57 10.73,37.6 7.92,37.6 5.97,39.55 5.97,62.16 6.64,62.83 13.07,62.83 13.34,63.1 | R4.2 R8.2 | R3.2 17.54,49.25 U$8.9 U$8.10 18.88,49.36 | H2.36 57.59,89.06
  Top 1.27: H2.38 H2.36
AD2
  Top 0.406: R18.1 84.92,22.92 R17.1 83.26,21.66 81.83,21.66 81.41,21.24 IC2.25
AD3
  Top 0.406: IC2.26 80.61,21.84 80.56,21.89 80.56,21.94 R20.1 79.02,23.18 R19.1
AD4/SDA  (via drill 0.6)
  Top 0.406: IC2.27 79.81,21.23 v79.45,22.09 | v60.19,18.99 60.18,18.69 60.2,16.43 59.53,15.75 58.74,14.99 55.85,14.98 U$29.P$1
  Bottom 0.406: v79.45,22.09 60.48,21.95 60.12,21.22 v60.19,18.99
AD5/SCI  (via drill 0.6)
  Top 0.406: IC2.28 79.01,18.2 v79.7,17.48 | v53.83,15.61 53.09,15.93 U$30.P$1
  Bottom 0.406: v79.7,17.48 54.47,17.48 v53.83,15.61
AGND_ADC  (via drill 0.6)  (3 unrouted)
  Top 0.2: U1.29 36.78,10.82 | U1.24 34.78,7.1
  Top 0.254: C7.2 35.89,30.72 37.09,30.72 37.52,30.29 U$15.P$1 37.47,28.33 37.47,27.39 36.76,26.79 34.65,26.79 34.38,26.41 U1.58 34.38,19.58 v34.25,19.45 | 32.03,31.49 29.9,31.49 29.49,31.08 | 29.49,31.08 29.49,29.25 U$16.P$1 29.36,29.12 29.36,27.89 29.6,27.65 v30.07,27.65 30.63,27.09 U$35.P$2 | U1.55 35.58,20.78 v34.25,19.45 | U1.6 32.84,19.28 | 32.84,19.28 34.08,19.28 v34.25,19.45 | U$25.P$2 43.23,26.24 44.21,27.22 44.21,28.12 C18.2 44.14,28.24 44.26,28.36 44.26,28.74 42.93,30.07 42.93,32.23 | U$37.P$2 32.15,25.76 31.64,26.27 30.73,26.27 | U$17.P$2 53.52,31.81 52.67,32.66 | 52.67,32.66 50.9,34.43 43.28,34.45 42.94,33.7 42.94,32.91 C25.- 41.51,32.25 v40.75,31.49 | U$7.P$2 19.46,36.41 21.3,34.57 26,34.57 29.49,31.08 | U1.34 37.11,15.68 36.81,15.38 36.81,14.2 | 63.05,21.88 U$27.P$2 63.02,23.15 62.46,23.71 U$12.P$2 61.24,23.75 61.24,24.64 60.96,24.92 60.09,24.92 59.35,24.18 C9.2 59.06,25.8 58.28,26.58 C3.2 53.89,28.89 52.29,30.49 52.29,32.28 52.67,32.66 | C6.2 57.96,4.6 v59.4,3.16 | C14.2 C15.2 | C14.2 49.63,2.98 v49.42,2.77 | C20.- 48.37,3.42 | 48.37,3.42 48.91,3.42 C14.2 | C21.2 45.11,7.67 48.07,4.71 48.07,3.72 48.37,3.42 | U1.7 32.44,18.88 | 32.44,18.88 32.84,19.28 | 47.63,9.02 v47.58,8.97 | v39.89,6.91 40.74,7.76 C17.2 40.78,10.24 42.84,10.24 43.05,10.45 U$11.P$2 | 36.78,10.82 37.23,10.37 38.06,10.37 U$19.P$2 U$18.P$2 38.14,8.66 v39.89,6.91 | v39.89,6.91 39.2,6.22 C16.2 38.25,6.04 38.25,4.95 37.61,4.31 U$10.P$2 | U$9.P$2 29.89,3.78 U$6.P$2 29.73,3.62 C12.2 29.76,5.77 30.95,5.77 31.05,6.37 31.07,8.07 33.08,12.69 U1.20 | U$9.P$2 32.7,3.78 v31.66,2.74 | U$9.P$2 33.67,4.61 C13.2 34.78,7.1
  Top 0.254: U1.13 32.35,16.48 32.69,16.82 32.69,18.63 32.44,18.88 | U$21.P$2 29.83,13.8 30.38,12.87 30.38,10.92 29.67,9.65 27.92,9.65 26.77,8.5 26.77,6.71 v26.74,6.68 | C22.- 21.68,6.87 v22.32,6.22 | v20.83,4.84 15.37,4.86 U$22.P$2 15.13,5.57 13.93,5.57 11.54,7.96 U$20.P$2 11.47,9.87 10.32,9.87 9.5,10.69 9.5,17.68 10.19,18.37 | U$23.P$2 10.66,18.84 10.19,18.37 | 10.19,18.37 10.19,21.65 13.53,24.99 U$24.P$2 17.39,25.06 17.39,27.03 18.32,27.96 23.55,27.96 23.93,27.58 | U$13.P$1 23.93,27.58 | U$14.P$1 24.35,28 23.93,27.58
  Top 0.406: C8.2 32.03,31.49 32.9,30.62 35.69,30.62 C7.2 | U$26.P$1 47.63,9.02
  Bottom 0.254: 57.7,7.39 57.57,5.79 57.68,5.68 | v34.25,19.45 34.25,7.16 34.78,6.63 | v40.75,31.49 33.91,31.49 v30.07,27.65 | v59.4,3.16 59.4,2.4 | v49.42,2.77 49.42,2.37 49.22,2.17 | 47.58,7.2 47.86,6.92 | v39.89,6.91 39.89,6.58 40.09,6.38 | v31.66,2.74 31.66,2.36 31.32,2.02 | v26.74,6.68 26.74,6.16 26.44,5.86 | v22.32,6.22 23.12,6.22 23.92,5.83 | v20.83,4.84 21.43,4.84 21.79,4.52
  Bottom 0.406: 59.87,6.04 59.76,6.04 59.64,6.16 | v47.58,8.97 47.58,7.2
  pour Bottom: 18.56,7.27 60.91,7.27 60.91,1.52 18.56,1.52
ALERT/BUSY
  Top 0.254: U1.35 41.75,16.08 R22.1
ANTENNA_DEPLOYMENT_+V  (1 unrouted)
  Top 1.27: 14.43,78.13 14.43,81.42 H1.1
ANTENNA_DEPLOYMENT_GND  (1 unrouted)
BOTTOM_TEMP_SOLAR_PANEL-1  (1 unrouted)
  Bottom 0.406: H2.9 25.79,85.3
BOTTOM_TEMP_SOLAR_PANEL-2  (1 unrouted)
  Bottom 0.406: H2.11 28.33,85.3
BOTTOM_TEMP_SOLAR_PANEL-3  (1 unrouted)
  Bottom 0.406: H2.13 30.91,85.26
BOTTOM_TEMP_SOLAR_PANEL-4  (1 unrouted)
  Bottom 0.406: H2.15 33.46,85.25
D1+
  Top 0.2: U1.11 15.52,17.28
  Top 0.254: 15.52,17.28 C23.+ 15.46,17.22 R25.1
D1-
  Top 0.2: U1.12 19.44,16.88
  Top 0.254: 19.44,16.88 17.45,15.07 17.45,12.84 16.85,12.06 15.54,12.06 C23.- 15.49,9.62 R26.2
D2+
  Top 0.2: U1.10 18.99,17.68
  Top 0.254: 18.99,17.68 17.58,19.09 16.45,19.09 15.85,19.69 15.85,20.68 C24.+ 13.54,20.71 R27.1
D2-
  Top 0.2: U1.9 22.57,18.08
  Top 0.254: 22.57,18.08 21.01,19.64 21.01,20.64 C24.- 21.07,24.27 R28.2
DCAP
  Top 0.254: U1.54 35.98,25.3 36.1,25.42 40.51,25.42 41.55,26.46 41.55,27.3 C18.1
DGND_ADC  (via drill 0.6)
  Top 0.2: U1.48 45.23,21.33 | U1.47 44.83,20.93 | U1.43 47.15,19.29 | U1.41 46.21,18.53
  Top 0.254: v48.75,22 47.74,21.3 45.23,21.33 44.83,20.93 | 47.15,19.29 v48.63,18.8 | 46.21,18.53 46.99,17.75 47.37,17.29 v48.68,16.85 48.7,16.89 U$28.P$2 | U1.36 37.84,16.48 37.59,16.73 37.59,16.89 | 37.59,16.89 37.59,17.3 | 37.59,17.3 37.59,18.15 37.92,18.48 U1.41 | U1.38 37.61,17.28 37.59,17.3 | U1.37 37.6,16.88 37.59,16.89
  Top 0.406: U$26.P$3 47.12,12.46 v47.58,12.92
  Bottom 0.254: v48.75,22 48.56,21.24 48.61,21.19 | v48.63,18.8 47.82,19.21 48.27,18.76 | v48.68,16.85 47.65,17.86 47.65,18.36 | 47.58,16.48 47.7,16.6
  Bottom 0.406: v47.58,12.92 47.58,16.48
  pour Bottom: 46.98,22.53 51.99,22.46 52,16.21 46.99,16.28
ELEC_BAY_TEMP_1
  Top 0.406: H2.50 75.38,90.17 74.96,90.59 13.54,90.59 12.49,89.54 12.49,87.53 10.44,85.48 8.24,85.48 R10.1
FACTORY_TEST
  Top 0.2: U1.14 28.29,16.08
  Top 0.254: 28.29,16.08 26.04,13.83 20.27,13.83 R24.2
G-M-COUNTS  (1 unrouted)
  Top 0.406: R15.2 64.8,23.61 63.65,23.61 60.3,26.96 58.95,26.96 58.09,27.82
G-M-OUTPUT-AMPLITUDE  (1 unrouted)
  Top 0.406: 89.44,20.02 87.37,18.88 IC2.24
GND  (via drill 0.6)  (3 unrouted)
  Top 0.254: 41.31,87.79 43.81,87.79 | 56.25,82.71 58.77,82.71 | 61.59,82.66 64.45,82.66 | 36.09,82.73 33.33,82.73
  Top 0.406: v10.83,79.74 7.28,78.38 6,77.9 U$31.P$1 | H2.17 H2.19 H2.22 40.22,89.06 41.31,87.79 | 43.81,87.79 H2.26 | H1.34 55.08,83.98 56.25,82.71 | 58.77,82.71 H1.37 60.41,81.44 61.59,82.66 | 64.45,82.66 65.21,81.82 H1.41 H1.44 H1.45 H1.48 H1.49 H1.52 80.11,81.78 U$33.P$1 | 36.09,82.73 H1.19 37.7,81.44 39.23,79.91 40.82,79.91 H1.23 42.35,81.21 43.56,80 45.99,80 H1.27 | 33.33,82.73 H1.15
  Top 1.27: H2.29 H2.30
  Bottom 0.254: H2.30 49.95,89.06 48.68,90.33 46.17,90.33 H2.26
  Bottom 0.406: v10.83,79.74 10.83,84.85 13.86,87.88 15.78,87.88 H2.4 18.07,89.06 18.19,89.18 18.19,89.53 18.97,90.31 30.94,90.31 H2.16 H2.17 | H2.30 H2.32 53.78,87.8 53.78,85.25 H1.34 | H1.19 37.41,82.53
GND1  (via drill 0.6)  (6 unrouted)
  Top 0.254: C1.2 86.4,17.41 v86.4,17.42 85.99,17.42 85.04,16.47 82.91,16.47 IC2.21 | C11.2 58.02,9.23 C10.2 60.7,9.57 v61.1,8.63
  Top 0.406: R6.1 38.46,45.7 R11.1 | U$8.18 9.99,61.71 v10.01,61.73 | C2.2 11.06,44.95 v10.05,43.94 | 87.33,78.15 v88.11,76.11 | U$31.P$2 5.58,77.31 v5.58,75.78 | C2.2 U$8.5 12.53,47.08 v10.54,47.08 | U$34.P$1 33.25,63.84 v32.35,62.37 | R12.1 21.8,37.01 v21.33,37.48 | R6.1 41.45,45.7 v40.27,46.88 | R5.1 53.21,47.8 52.51,48.5 44.05,48.5 43.37,47.82 43.37,45.75 R6.1 | R18.2 87.7,25.55 v88.34,26.19 | R20.2 81.8,26.34 v81.66,26.48 | C4.2 69.64,17.81 v70.7,15.98 71.68,15.72 74.28,15.69 | C5.2 71.99,10.1 v72.02,10.13 | U$26.P$2 46.27,11.49 v46.19,10.42
  GND1 0.254: 69.92,17.73 69.64,18.01 | v86.4,17.42 85.6,17.42 85.6,17.51 85.65,17.51 | v61.1,8.63 60.03,7.64 60.45,7.18 | v46.19,10.42 46.49,10.26
  GND1 0.406: v10.05,43.94 10.05,43.08 9.96,42.99 | v88.11,76.11 88.24,75.51 | v5.58,75.78 6.01,75.35 6.01,74.41 | v32.35,62.37 32.25,61.76 | 88.95,32.36 87.05,31.93 | v21.33,37.48 21.33,37.94 20.79,38.48 | v40.27,46.88 40.27,47.6 40.38,47.71 | v88.34,26.19 88.34,26.6 88.57,26.83 | v81.66,26.48 81.08,26.48 | v70.7,15.98 70.85,16.34 71.21,17.02 | v72.02,10.13 72.44,10.13 72.47,10.1
  Bottom 0.406: v10.01,61.73 10.01,61.68 10.06,61.63 | v10.54,47.08 10.54,47.04
  other vias: 67.08,30.75
  pour GND1: 0.34,91.66 90.25,91.73 90.49,0.19 0.18,0.22 -0.13,22.64 arc90 4.88,27.59 4.88,69.84 arc90 0.78,74.23 0.26,74.23 arc-90 0,74.49 0.21,91.93
GND2  (1 unrouted)
GND3  (2 unrouted)
HV_OUTPUT1  (1 unrouted)
  Top 0.406: 89.08,35.76 89.15,34.59 88.48,27.79 86.84,26.58 84.86,25.02 R17.2
HV_OUTPUT2  (via drill 0.6)  (1 unrouted)
  Top 0.406: R19.2 75.65,27.12 v75.83,27.3
IO2
  Top 0.406: IC2.32 75.8,21.18 70.46,21.18 R15.1 70.05,22.54 69.04,23.55 69.04,25.15 R16.1 68.15,25.86
ISENSE1OVERRANGE
  Top 0.2: U1.46 59.01,20.53
  Top 0.254: 59.01,20.53 U$12.P$1
ISENSE2OVERRANGE
  Top 0.2: U1.45 58.65,20.13
  Top 0.254: 58.65,20.13 59.87,20.13 61.67,21.93 62.38,21.93 U$27.P$1
N$3  (via drill 0.6)
  Top 0.406: v72.46,6.84 73.95,7.5 76.54,7.5 77.12,8.62 77.75,8.62 v78.48,9.48 | v82.16,9.96 81.5,10.55 IC2.16
  Bottom 0.406: v72.46,6.84 72.47,3.95 73.44,3.24 74.33,3.24 JP1.1 | v78.48,9.48 80.3,9.72 v82.16,9.96
N$6  (via drill 3.3)
  other vias: 9.06,88.85
N$7  (via drill 3.3)
  other vias: 82.73,88.86
N$8  (via drill 3.3)
  other vias: 85.26,3.13
N$9  (via drill 3.3)
  other vias: 5.26,3.13
N$12
  Top 0.254: R28.1 17.6,24.47 U$24.P$3
N$14
  Top 0.254: C22.+ 26.93,13.2 U$21.P$4
N$16
  Top 0.254: R27.2 11.82,19.15 U$23.P$3
N$17
  Top 0.254: U$25.P$4 43.3,25.24 44.02,24.52 44.68,24.52 45.68,25.52 45.68,28.13 48.05,30.5 48.05,32.15 C25.+
N$21
  Top 0.406: U$4.P$2 29.33,41.4 R7.2
N$24
  Top 0.254: R26.1 15.6,5.84 U$22.P$3
N$25
  Top 0.254: R25.2 12.02,10.78 11.97,10.73 11.97,10.11 U$20.P$3
N$47
  Top 0.254: 64.53,15.08 U$5.P$2
  Top 0.406: IC2.7 74.3,14.06 68.92,14.06 R1.1 | R1.1 68.62,15.95 C4.1 | R1.1 65.56,14.36 U$5.P$2
N$48
  Top 0.406: U$5.P$1 66.5,5.89 68.64,8.03 C5.1 68.64,12.56 R1.2 69.27,13.23 70.9,13.23 IC2.8
N$51
  Top 0.406: IC2.15 80.66,8.84 79.66,8 78.11,7.99 77.73,7.47 77.75,6.24 JP1.4
N$58
  Top 0.406: R2.2 48.36,37.13 U$2.P$2
NC_3
  Top 0.254: U1.5 28.26,19.68 R29.1
NC_4
  Top 0.2: U1.8 24.76,18.48
  Top 0.254: 24.76,18.48 R30.1
NC_7
  Top 0.2: U1.25 35.18,4.3
  Top 0.254: 35.18,4.3 R23.1
NC_10
  Top 0.254: R21.2 39.5,27.29 38.52,26.31 35.12,26.34 34.76,26.02 34.77,22.54 U1.57
OFFSETINA
  Top 0.254: U1.18 32.44,14.11 32.42,12.48 30.09,8.83 30.03,8.72 29.72,8.3 C12.1 28.43,7.5 28.01,7.08 28.01,4.87 28.58,4.3 29.55,4.3 U$6.P$1
OFFSETINB
  Top 0.2: U1.23 34.38,9.6
  Top 0.254: 34.38,9.6 33.72,8.94 33.72,7.74 C13.1 32.51,7.69 32.16,7.34 32.16,5.08 U$9.P$1
OFFSETINC
  Top 0.2: U1.26 35.58,8.19
  Top 0.254: 35.58,8.19 36.41,7.36 36.41,6.26 C16.1 36.41,6.18 36.41,4.6 36.92,4.09 U$10.P$1
OFFSETIND  (1 unrouted)
  Top 0.2: U1.31 37.58,12.83
  Top 0.254: 37.58,12.83 38.49,11.92 40.72,11.92 | U$11.P$1 41.88,11.86 C17.1
PC_Q6_RS232  (via drill 0.6)
  Top 0.406: U$8.7 15.07,47.46 v15.69,46.84
  Bottom 0.406: H1.21 39.77,81.4 39.77,65.48 26.57,52.27 26.05,51.76 21.13,46.84 v15.69,46.84
POW_5V  (via drill 0.6)
  Top 0.2: U1.44 54.31,19.73 | U1.42 46.86,18.89
  Top 0.254: 46.86,18.89 47.8,17.89 55.81,17.83 | 55.81,17.83 57.11,17.8 U$28.P$1 | 54.31,19.73 54.32,19.72 54.4,19.72 54.82,19.3 54.82,18.63 55.81,17.83 | 36.5,33.57 39.5,30.57 R21.1 39.58,29.24 40.65,29.24 40.92,28.97 40.92,26.72 40.06,25.86 35.52,25.86 35.18,25.52 U1.56 | C3.1 54.29,24.18 C9.1 56.58,24.18 55.69,23.29 55.69,22.25 v55.74,22.2 | U1.42 37,18.88 36.37,18.25 36.37,15.7 | 36.37,15.7 36.34,14.15 U1.28 | R22.2 44.63,15.53 v44.52,13.34 44.31,13.13 44.31,9.55 | C10.1 55.9,12.58 U$29.P$2 55.78,12.74 54.89,11.85 52.13,11.85 | 52.13,11.85 51.43,12.55 U$30.P$2 51.43,12.88 v50.11,11.56 | 52.13,11.85 52.5,11.48 C11.1 50.51,9.23 | 50.51,9.23 49.69,9.23 C15.1 49.75,9.29 49.78,9.32 | C6.1 51.79,4.6 C14.1 51.33,6.85 51.03,7.15 51.03,8.71 50.51,9.23 | 44.31,9.55 43.63,9.55 42.9,8.82 42.9,7.08 42.44,6.62 41.42,6.62 40.19,5.38 C20.+ 39.34,2.58 R23.2 | 44.31,9.55 C21.1 | U1.21 33.58,15.6 33.87,15.89 36.18,15.89 36.37,15.7 | R24.1 18.51,10.44 v19.16,8.71 | v23.06,22.57 24.07,21.56 R30.2 24.3,21.1 25.39,21.1 26.05,20.44 R29.2
  Top 0.406: C8.1 35.7,33.43 C7.1 36.5,33.57 38.4,35.47 38.4,36.32 | 38.4,36.32 38.4,38.97 U$4.P$1 | U$2.P$1 42.1,37.24 40.47,35.61 39.92,35.61 | 39.92,35.61 39.11,35.61 38.4,36.32 | C1.1 87.58,14.36 | IC2.4 74.31,16.47 | v88.94,13 88.98,13.94 88.56,14.41 C1.1 | IC2.4 74.26,16.54 | 51.44,15.39 U$30.P$2 | 39.92,35.61 v39.92,36.48 | IC2.18 87.21,14.08 C1.1 | R31.2 70.95,25.87 D1.C 73.21,25.87 v72.32,27.04 | U$28.P$1 57.38,17.91 v57.62,18.88 | IC2.4 73.12,16.48 72.89,16.71 72.89,19.06 v72.16,19.79
  POW_5V 0.254: v55.74,22.2 55.74,22.14 56.16,21.72 | v44.52,13.34 46.86,13.93 46.89,13.96 | v50.11,11.56 50.11,11.49 49.62,11 | v19.16,8.71 19.2,9.61 19.56,9.25 | v23.06,22.57 23.06,22.93 22.97,23.02
  POW_5V 0.406: v39.92,36.48 39.92,36.73 40.16,36.97 39.91,38.32 42.09,36.14 | v72.32,27.04 72.26,26.72 72.19,26.79 72.19,26.83 71.88,27.14 | v57.62,18.88 55.87,18.85 55.7,19.02 55.4,19.02 | v72.16,19.79 71.66,19.79 71.63,19.76
  pour POW_5V: 0.42,91.94 90.43,91.86 90.48,0.1 0.18,-0.13 0.38,22.54 arc90 4.9,27.56 4.9,69.82 arc90 0.26,74.1 0.5,74.29 arc-90 0.09,74.4 0.32,91.71
POW_RADIO_3.3V
  Top 0.406: H1.16 32.19,84.77 32.67,85.25 46.17,85.25 H2.27
  Top 1.27: H2.27 H2.28
PS1+
  Top 0.254: U1.62 32.78,24.06 U$37.P$1
PS2+
  Top 0.254: U1.63 32.38,23.4 31.97,23.81 31.07,23.81 30.03,24.85 30.03,26.15 U$35.P$1
Q6_I2C_SCL_1  (via drill 0.6)  (2 unrouted)
  Top 0.406: R4.1 20.13,40.07 v29.55,49.49
  Bottom 0.406: H2.20 38.56,87.77 40.34,87.77 41.11,87 | v29.55,49.49 29.84,49.7
Q6_I2C_SDA_1  (via drill 0.6)  (2 unrouted)
  Top 0.406: R3.1 21.35,44.95 v24.1,47.7
  Bottom 0.406: H2.18 36.05,87.74 36.05,85.77 36.53,85.29 37.86,85.29 38.55,84.61 | v24.1,47.7 24.1,47.82 40.24,63.96
Q6_PC_RS232  (via drill 0.6)
  Top 0.406: U$8.8 16.34,50.75 16.72,51.13 23.93,51.13 v26.73,48.33
  Bottom 0.406: H1.25 44.92,81.42 44.92,66.4 26.59,48.33 v26.73,48.33
Q6_RADIO_UART_RX  (via drill 0.6)
  Top 0.406: v23.87,52.17 14.84,52.17 13.8,51.13 U$8.6
  Bottom 0.406: H1.18 36.05,82.67 35.99,64.29 v23.87,52.17
Q6_RADIO_UART_TX  (via drill 0.6)
  Top 0.406: v22.32,53.28 13.4,53.54 11.28,51.42 11.28,49.34 U$8.4
  Bottom 0.406: H1.17 34.76,81.42 34.76,65.29 v22.32,53.28
Q6_SPI_CS0  (via drill 0.6)  (1 unrouted)
  Top 0.406: H2.14 28.34,87.74 28.34,79.41 v29.48,78.27 v29.48,78.26
  Bottom 0.406: v29.48,78.27 29.48,62.59 22.1,55.21 9.81,55.21 8.49,53.89 8.49,40.44 8.74,40.19
Q6_SPI_CS1  (via drill 0.6)
  Top 0.406: H2.12 25.87,87.81 25.87,79.24 v26.96,78.15 27.02,78.15 | v15.91,34.41 R8.1
  Bottom 0.406: v26.96,78.15 26.96,62.62 21.36,57.02 8.66,57.02 6.85,55.21 6.85,35.56 8.08,34.33 15.83,34.33 v15.91,34.41
REFOUT/REFINADC
  Top 0.254: U1.53 36.38,24.71 36.62,24.95 41.91,24.95 U$25.P$1
REFOUT/REFINDAC
  Top 0.2: U1.15 28.68,15.68
  Top 0.254: 28.68,15.68 28.02,15.02 U$21.P$1
RESET
  Top 0.254: 78.21,16.66 83.62,11.25
  Top 0.406: IC2.29 78.13,20.45 | R31.1 70.82,23.74 72.12,22.44 74.22,22.44 D1.A 77.1,22.47 78.02,21.55 78.02,21.51 78.15,21.38 78.15,20.43 IC2.29 | IC2.29 78.21,16.66 | 83.62,11.25 83.62,9.31 81.4,6.94 81.4,4.66 JP1.5
RS1+
  Top 0.254: U$15.P$2 36.56,28.04 R14.1 33.84,27.07 33.79,26.64 33.79,23.85 33.58,23.64 U1.60
RS1-
  Top 0.254: U1.61 33.18,27.54 R14.2 31.58,29.14 U$16.P$2
RS2+
  Top 0.2: 29.81,20.48 29.18,21.11
  Top 0.254: U1.3 29.81,20.48 | 29.18,21.11 29.18,22.25 27.99,23.44 26.57,23.44 R13.1 25.17,23.47 24.04,24.6 24.04,25.14 U$13.P$2
RS2-
  Top 0.2: 30.03,20.88 29.57,21.34
  Top 0.254: U1.2 30.03,20.88 | 29.57,21.34 29.57,23.94 28.09,25.42 26.59,25.42 R13.2 26.54,27.31 U$14.P$2
SCK
  Top 0.406: JP1.3 79.07,1.48 80.78,1.48 82.14,2.38 82.14,6.07 82.9,7.01 85.76,10.68 85.59,12.58 84.68,13.2 IC2.17
SCL
  Top 0.2: U1.40 45.92,18.08
  Top 0.254: U$30.P$3 47.22,15.69 45.96,18.12 45.92,18.08
SDA  (via drill 0.6)
  Top 0.2: U1.39 45.55,17.72
  Top 0.254: v49.95,14.3 47.32,14.29 45.55,17.72
  Top 0.406: U$29.P$3 53.51,13.22 v53.12,13.25
  Bottom 0.406: v53.12,13.25 50.29,14.19 v49.95,14.3
SOLAR_PANEL_1_3  (1 unrouted)
  Top 1.27: H1.29 50.14,79.52 51.13,78.89
SOLAR_PANEL_2_4  (1 unrouted)
SOLAR_PANEL_GND_1  (1 unrouted)
  Bottom 0.406: H1.30 51.26,82.78 51.26,78.52
  Bottom 1.27: 51.26,78.52 51.32,78.09 52.48,76.93
SOLAR_PANEL_GND_2  (1 unrouted)
  Bottom 0.406: H1.31 52.51,81.55 52.58,81.62
  Bottom 1.27: 52.58,81.62 52.58,79.57 53.46,78.69
THERMALGND  (via drill 0.6)  (2 unrouted)
  Top 0.406: R10.2 8.85,81.1 13.05,85.3 13.05,86.91 13.85,87.79 17.92,87.79 18.19,87.25 18.22,82.58 H1.5
  Bottom 0.406: H1.5 19.47,81.42
  other vias: 56.9,36.19
TOP_TEMP_SOLAR_PANEL-1  (1 unrouted)
  Bottom 0.406: H2.1 15.58,85.2
TOP_TEMP_SOLAR_PANEL-2  (2 unrouted)
  Bottom 0.406: H2.3 18.22,85.25 | 18.22,74.19 18.21,74.18
TOP_TEMP_SOLAR_PANEL-3  (1 unrouted)
  Bottom 0.406: H2.5 20.67,85.22
TOP_TEMP_SOLAR_PANEL-4  (1 unrouted)
  Bottom 0.406: H2.7 23.24,85.25
VCCA  (1 unrouted)
VCCY  (1 unrouted)
VOLTAGE_SWEEP1  (via drill 0.6)  (1 unrouted)
  Top 0.406: U$2.P$4 48.2,45.22 | 48.2,45.22 R6.2 | 48.2,45.22 48.59,45.22 v50.27,47.05
VOLTAGE_SWEEP2  (via drill 0.6)  (1 unrouted)
  Top 0.406: R12.2 31.96,37.01 U$4.P$4 29.69,36.8 28.56,37.93 28.56,39.29 v28.87,39.6
  Bottom 0.406: v28.87,39.6 40.71,39.6 49.53,48.42 53.67,48.42
VOUTA  (via drill 0.6)
  Top 0.254: U1.19 32.78,16.19 v36.95,20.36 | v55.4,29.15 55.4,30.1 U$17.P$1
  Top 0.406: R5.2 54.33,40.18 R2.1 56.22,35.24 56.22,32.34 55.07,31.19 U$17.P$1
  Bottom 0.254: v36.95,20.36 41.86,20.36 50.34,28.84 55.09,28.84 v55.4,29.15
VOUTB  (via drill 0.6)  (1 unrouted)
  Top 0.2: U1.22 34,12.99
  Top 0.254: 34,12.99 v33.15,10.17 | v18.23,33.17 18.23,37.19 18.62,37.58 19.42,37.58 U$7.P$1
  Top 0.406: 33.19,44.83 R7.1 28.56,44.65 26.5,44.65 19.67,37.82 U$7.P$1 | 33.19,44.83 R11.2 | 33.19,44.83 33.19,46.28
  GND1 0.406: 36.22,48.38 36.3,48.3
  Bottom 0.254: v33.15,10.17 7.85,10.08 5.59,14.35 5.59,28.69 8.16,31.26 16.32,31.26 v18.23,33.17
VOUTC
  Top 0.2: U1.27 35.98,9.56
  Top 0.254: 35.98,9.56 36.79,8.75 U$18.P$1
VOUTD
  Top 0.2: U1.30 37.18,12.43
  Top 0.254: 37.18,12.43 38.1,11.51 38.1,10.95 U$19.P$1